# Altium project MOTHERBOARD_hristo.PrjPcb (part 1 of 2)
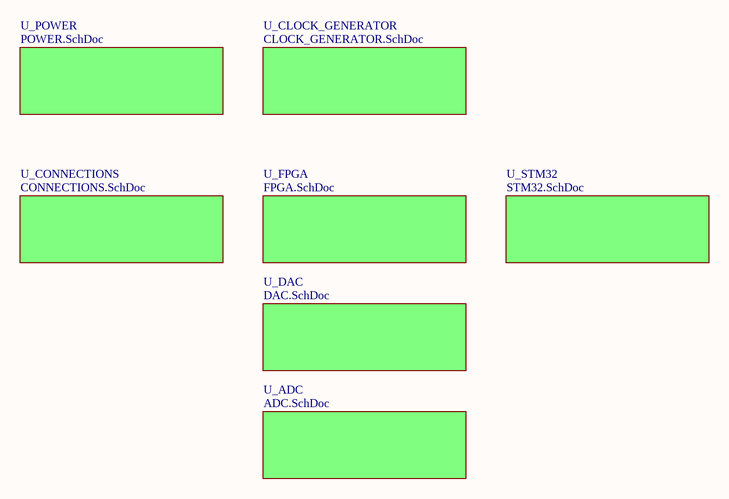
[diagram p0: MOTHERBOARD.SCHDOC]
8 sheets, 230 parts. Net scope: global (net labels, ports and power ports of the same name join across sheets).
Board file: MOTHERBOARD_Hristo_JLC2313.PcbDoc
Sheets:
  MOTHERBOARD.SCHDOC
    U_ADC = ADC.SchDoc
    U_DAC = DAC.SchDoc
    U_FPGA = FPGA.SchDoc
    U_POWER = POWER.SchDoc
    U_STM32 = STM32.SchDoc
    U_CLOCK_GENERATOR = CLOCK_GENERATOR.SchDoc
    U_CONNECTIONS = CONNECTIONS.SchDoc

## Sheet MOTHERBOARD.SCHDOC: MOTHERBOARD
size A4; DocumentNumber: 2; Revision: 2.0; SheetNumber: 2; SheetTotal: 18

### Sub-sheets
U_ADC = ADC.SchDoc: no entries
U_CLOCK_GENERATOR = CLOCK_GENERATOR.SchDoc: no entries
U_CONNECTIONS = CONNECTIONS.SchDoc: no entries
U_DAC = DAC.SchDoc: no entries
U_FPGA = FPGA.SchDoc: no entries
U_POWER = POWER.SchDoc: no entries
U_STM32 = STM32.SchDoc: no entries

### Notes on the sheet
- Title
- Size:
- Date:
- A4
- Number:
- Time:
- Revision:
- Sheet
- of
- File:

## Sheet ADC.SchDoc: ADC
size A4; DocumentNumber: 3; Revision: 2.0; SheetNumber: 3; SheetTotal: 18
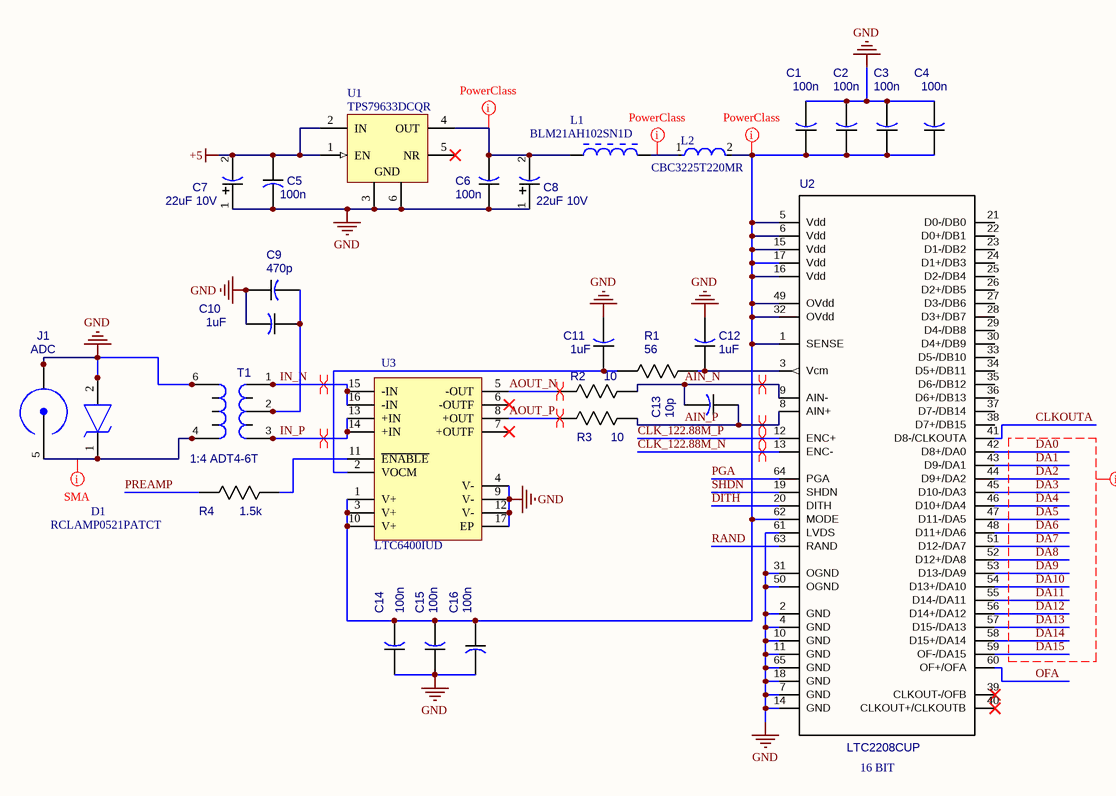
[diagram p1: ADC.SchDoc]

### Parts
C1  100n  [CAP_0805]
C2  100n  [CAP_0805]
C3  100n  [CAP_0805]
C4  100n  [CAP_0805]
C5  100n  [CAP_0805]
C6  100n  [CAP_0805]
C7  22uF 10V  [CAPAE_4.3x4.3h5.4]
C8  22uF 10V  [CAPAE_4.3x4.3h5.4]
C9  470p  [CAP_0805]
C10  1uF  [CAP_0805]
C11  1uF  [CAP_0805]
C12  1uF  [CAP_0805]
C13  10p  [CAP_0805]
C14  100n  [CAP_0805]
C15  100n  [CAP_0805]
C16  100n  [CAP_0805]
D1  RCLAMP0521PATCT  [RCLAMP0521PATCT]
J1  ADC  [31-5431]
L1  BLM21AH102SN1D  [INDC2013X105X50NL20T20]
L2  CBC3225T220MR  [FP-CB3225-IPC_B]
R1  56  [RES_0805]
R2  10  [RES_0603]
R3  10  [RES_0603]
R4  1.5k  [RES_0805]
T1  1:4 ADT4-6T  [TRANSF_ACORE2]
U1  TPS79633DCQR  [DCQ0006A_L]
U2  LTC2208CUP  [LTC2208CUP]
U3  LTC6400IUD  [LT-UD-16_N]

### Nets
+5: C5.1 C7.2(MINUS) U1.1(EN) U1.2(IN)
CLK_122.88M_N: U2.13(ENC-)
CLK_122.88M_P: U2.12(ENC+)
GND: C1.2 C2.2 C3.2 C4.2 C5.2 C6.1 C7.1(PLUS) C8.1(PLUS) C9.1 C10.2 C11.2 C12.2 C14.1 C15.1 C16.2 D1.2(A) J1.1(GND) J1.2(GND) J1.3(GND) J1.4(GND) T1.6(P2) T1.10 U1.3(GND) U1.6(GND) U2.2(GND) U2.4(GND) U2.7(GND) U2.10(GND) U2.11(GND) U2.14(GND) U2.18(GND) U2.31(OGND) U2.50(OGND) U2.61(LVDS) U2.65(GND) U3.4(V-) U3.9(V-) U3.12(V-) U3.17(EP)
AIN_N: C13.2 R2.2 U2.9(AIN-)
AIN_P: C13.1 R3.2 U2.8(AIN+)
AOUT_N: R2.1 U3.5(-OUT)
AOUT_P: R3.1 U3.8(+OUT)
CLKOUTA: U2.41(D8-/CLKOUTA)
DA0: U2.42(D8+/DA0)
DA1: U2.43(D9-/DA1)
DA2: U2.44(D9+/DA2)
DA3: U2.45(D10-/DA3)
DA4: U2.46(D10+/DA4)
DA5: U2.47(D11-/DA5)
DA6: U2.48(D11+/DA6)
DA7: U2.51(D12-/DA7)
DA8: U2.52(D12+/DA8)
DA9: U2.53(D13-/DA9)
DA10: U2.54(D13+/DA10)
DA11: U2.55(D14-/DA11)
DA12: U2.56(D14+/DA12)
DA13: U2.57(D15-/DA13)
DA14: U2.58(D15+/DA14)
DA15: U2.59(OF-/DA15)
DITH: U2.20(DITH)
IN_N: T1.1(S3) T1.7 U3.15(-IN) U3.16(-IN)
IN_P: T1.3(S1) T1.9 U3.13(+IN) U3.14(+IN)
OFA: U2.60(OF+/OFA)
PGA: U2.64(PGA)
PREAMP: R4.2
RAND: U2.63(RAND)
SHDN: U2.19(SHDN)
NetC1_1: C1.1 C2.1 C3.1 C4.1 C14.2 C15.2 C16.1 L2.2 U2.1(SENSE) U2.5(Vdd) U2.6(Vdd) U2.15(Vdd) U2.16(Vdd) U2.17(Vdd) U2.32(OVdd) U2.49(OVdd) U2.62(MODE) U3.1(V+) U3.3(V+) U3.10(V+)
NetC6_2: C6.2 C8.2(MINUS) L1.1 U1.4(OUT)
NetC9_2: C9.2 C10.1 T1.2(S2) T1.8
NetC11_1: C11.1 R1.1 U3.2(VOCM)
NetC12_1: C12.1 R1.2 U2.3(Vcm)
NetD1_1: D1.1(K) J1.5(CON) T1.4(P1) T1.11
NetL1_2: L1.2 L2.1
NetR4_1: R4.1 U3.11(~{ENABLE})

Not connected (* = marked no-connect by the designer): U1 5(NR)*; U2 21(D0-/DB0) 22(D0+/DB1) 23(D1-/DB2) 24(D1+/DB3) 25(D2-/DB4) 26(D2+/DB5) 27(D3-/DB6) 28(D3+/DB7) 29(D4-/DB8) 30(D4+/DB9) 33(D5-/DB10) 34(D5+/DB11) 35(D6-/DB12) 36(D6+/DB13) 37(D7-/DB14) 38(D7+/DB15) 39(CLKOUT-/OFB)* 40(CLKOUT+/CLKOUTB)*; U3 6(-OUTF)* 7(+OUTF)*

### Layout directives
rule Width Constraint [Pref Impedance = 50.00ohms    Min Impedance = 50.00ohms    Max Impedance = 50.00ohms]: NetD1_1
differential pair: AIN_N, AIN_P, AOUT_N, AOUT_P, CLK_122.88M_N, CLK_122.88M_P, IN_N, IN_P
net class PowerPads: NetC1_1, NetC6_2, NetL1_2
net class ADC_DATA: DA0, DA1, DA2, DA3, DA4, DA5, DA6, DA7, DA8, DA9, DA10, DA11, DA12, DA13, DA14, DA15

### Notes on the sheet
- 16 BIT
- Title
- Size:
- Date:
- A4
- Number:
- Time:
- Revision:
- Sheet
- of
- File:

### Library data of the parts
C1-C6 C9-C16 = CAP_0805
  C1-C6 C14-C16: Value: 100n
  C9: Value: 470p
  C10-C12: Value: 1uF
  C13: Value: 10p
C7 C8 = CAPAE_4.3x4.3h5.4: Value: *
D1 = RCLAMP0521PATCT: TVS Diode (Uni-directional); Manufacturer_Name: SEMTECH; Datasheet Link: https://datasheet.datasheetarchive.com/originals/distributors/Datasheets-DGA26/1841510.pdf; Manufacturer_Part_Number: RCLAMP0521PATCT; Mouser Part Number: 947-RCLAMP0521PATCT; Mouser Price/Stock: https://www.mouser.co.uk/ProductDetail/Semtech/RCLAMP0521PATCT?qs=rBWM4%252BvDhIfB36%252BFxGdBkA%3D%3D; Arrow Part Number: RCLAMP0521PATCT; Arrow Price/Stock: https://www.arrow.com/en/products/rclamp0521patct/semtech?region=nac
J1 = 31-5431: SMA; Value: ADC
L1 = CMP-2000-05954-1: Chip Bead, 1000 Ohm, +/- 25%, 200 mA, -55 to 85 degC, 2-Pin SMD, RoHS, Tape and Reel; Manufacturer: Murata; Brand: MurataElectronics; Test Frequency: 100MHz; Maximum DC Resistance: 450mOhms; Case Length: 2mm; Maximum DC Current: 200mA; Case Height: 0.85mm; Case Width: 1.25mm; Impedance: 1kOhms; Datasheet URL: http://datasheet.octopart.com/BLM21AH102SN1D-Murata-datasheet-629859.pdf; Datasheet Version: 11/2017; Dimensions: 1.25mmWx2mmLx0.85mmH; Manufacturer URL: http://www.murata.com/; Packaging: Reel; Product: FerriteChipBeads; Product Category: EMIFilterBeads,Chips&Arrays; Operating Temperature Range: -55Cto+125C; Package / Case: 0805(2012metric); Series: BLM21A; Mounting Technology: SurfaceMount; Termination Style: SMD/SMT; Tolerance: 25%; RoHS: Details; Package Reference: 0805; Factory Pack Quantity: 4000; Package Description: 2-Pin Surface Mount Device, Body 2 x1.25 mm
L2 = CMP-14484-000363-1: SMD Inductors 22uH ±20% 0.78A 0.351Ω 1210; Test Frequency: 100kHz; DC Current: 780mA; Core Material: Ferrite; Self Resonant Frequency: 17MHz; DC Resistance (DCR): 351mR; Saturation Current: 620mA; Shielding: Unshielded; Height: 2.5mm; Tolerance: 20%; Max Operating Temperature: 105°C; Inductance: 22uH; Series: CB; Width: 0.098inch; Military Standard: Not; RoHS Compliant: Yes; Depth: 2.7mm; Max DC Current: 780mA; Package Quantity: 1000; Lead Free: Lead Free; Number of Pins: 2; Min Operating Temperature: -40°C; Current Rating: 780mA; Halogen Free: Halogen Free; Radiation Hardening: No; Case Code (Metric): 3225; Inductance Tolerance: 20%; Case Code (Imperial): 1210; Termination: SMD/SMT; Resistor Type: Wirewound; Mount: Surface Mount; Case/Package: 1210; Length: 0.126inch; Height - Seated (Max): 0.106inch; Packaging: Tape and Reel
R1 R4 = RES_0805
  R1: Value: 56
  R4: Value: 1.5k
R2 R3 = RES_0603: Value: 10
T1 = TRANSF_ACORE2: Transformer; Value: 1:4 ADT4-6T
U1 = CMP-0395-00327-2: Single Output High PSRR LDO, 1 A, Fixed 3.3 V Output, 2.7 to 5.5 V Input, 6-pin SOT-223 (DCQ), -40 to 125 degC, Green (RoHS & no Sb/Br); Manufacturer: Texas Instruments; Accuracy(%): 2; Iout(Max)(A): 1; Vdo(Typ)(mV): 220; SubFamily: Single Channel LDO; Vout Adj(Min)(V): 3.3; Vin(Max)(V): 5.5; Iq(Typ)(mA): 0.26; Vin(Min)(V): 2.7; DatasheetVersion: SLVS351N; ComponentLink2Description: Datasheet; PartNumber: TPS79633DCQR; PackageDescription: 6-Pin Plastic Small Outline, Body 3.5 x 6.5 mm, Pitch 1.27 mm; ComponentLink1Description: Manufacturer URL; ComponentLink2URL: http://www.ti.com/general/docs/lit/getliterature.tsp?genericPartNumber=TPS79633&fileType=pdf; ComponentLink3URL: http://www.ti.com/litv/pdf/mpds098c; Mounting Technology: Surface Mount; Fixed Output Options(V): 3.3; PackageReference: DCQ0006A; ComponentLink1URL: http://www.ti.com/; PackageVersion: 4202109/D; ComponentLink3Description: Package Specification; Vout Adj(Max)(V): 3.3; Eco-Plan: Green (RoHS & no Sb/Br)
U3 = CMP-0359-03855-2: Single Channel, Low Noise, Low Distortion Differential ADC Driver for 300 MHz IF, 1800 MHz Typical GBW, 4500 V/us Typical SR, 2.85 to 3.5 V, 16-Pin QFN (UD-16), Industrial, Pb-Free; Manufacturer: Linear Technology; Linear Technology Part Number: LTC6400-20; PartNumber: LTC6400IUD-20#PBF; Vs Min (V): 2.85; SR (V/us) Typical: 4500; Is (mA) Typical: 90; Vs Max (V): 3.5; Vos (mV) Typical: 2; GBW (MHz) Typical: 1800; Channels (#): 1; RoHS: Pb-Free; PackageReference: LT-UD-16; Type: DIFF; ComponentLink3Description: Package Specification; PackageDescription: 16-Lead Plastic QFN, Body 3.00 x 3.00 mm, Pitch 0.5 mm; ComponentLink1URL: http://www.linear.com/; Mounting Technology: Surface Mount; ComponentLink2URL: http://cds.linear.com/docs/en/datasheet/640020f.pdf; Code_JEDEC: MO-220; ComponentLink3URL: http://cds.linear.com/docs/en/packaging/QFN_16_05-08-1691.pdf; ComponentLink2Description: Datasheet; ComponentLink1Description: Manufacturer URL; RevisionNote: URLs updated
U2 = LTC2208CUP: Value: LTC2208CUP

## Sheet DAC.SchDoc: DAC
size A4; DocumentNumber: 8; Revision: 2.0; SheetNumber: 8; SheetTotal: 18
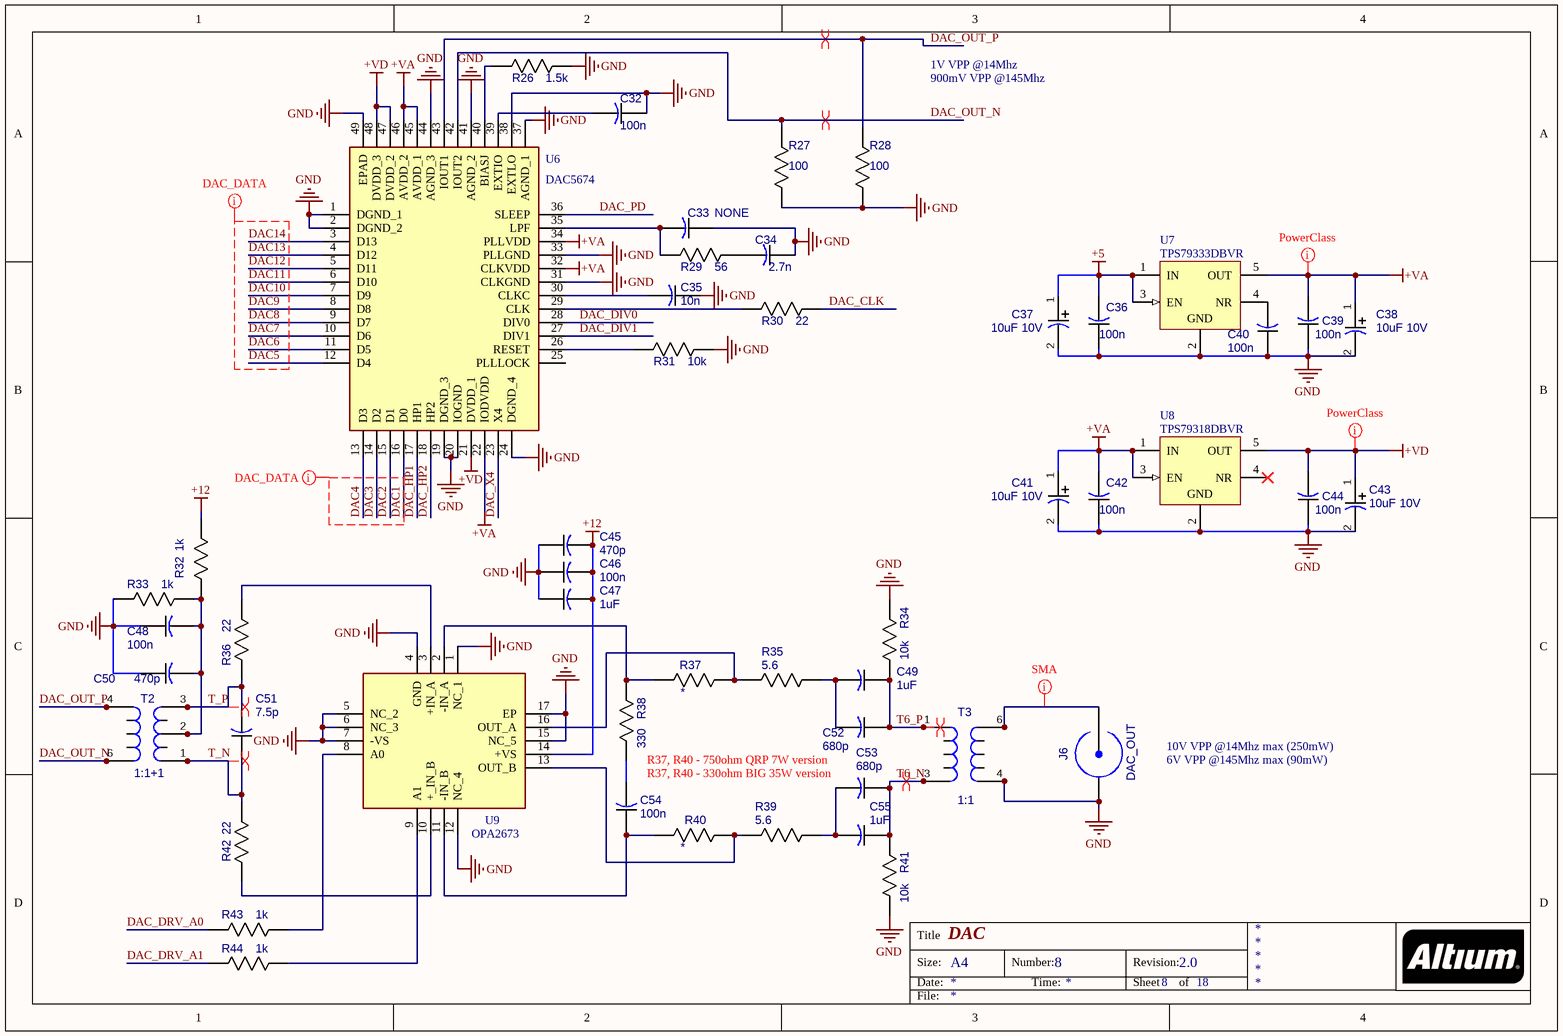
[diagram p2: DAC.SchDoc]

### Parts
C32  100n  [CAP_0805]
C33  NONE  [CAP_0805]
C34  2.7n  [CAP_0805]
C35  10n  [CAP_0805]
C36  100n  [CAP_0805]
C37  10uF 10V  [CAPAE_4.3x4.3h5.4]
C38  10uF 10V  [CAPAE_4.3x4.3h5.4]
C39  100n  [CAP_0805]
C40  100n  [CAP_0805]
C41  10uF 10V  [CAPAE_4.3x4.3h5.4]
C42  100n  [CAP_0805]
C43  10uF 10V  [CAPAE_4.3x4.3h5.4]
C44  100n  [CAP_0805]
C45  470p  [CAP_0805]
C46  100n  [CAP_0805]
C47  1uF  [CAP_0805]
C48  100n  [CAP_0805]
C49  1uF  [CAP_1206]
C50  470p  [CAP_0805]
C51  7.5p  [CAP_0805]
C52  680p  [CAP_1206]
C53  680p  [CAP_1206]
C54  100n  [CAP_0805]
C55  1uF  [CAP_1206]
J6  DAC_OUT  [31-5431]
R26  1.5k  [RES_0805]
R27  100  [RES_0805]
R28  100  [RES_0805]
R29  56  [RES_0805]
R30  22  [RES_0805]
R31  10k  [RES_0805]
R32  1k  [RES_0805]
R33  1k  [RES_0805]
R34  10k  [RES_0805]
R35  5.6  [RES_1206]
R36  22  [RES_0805]
R37  *  [RES_0805]
R38  330  [RES_0805]
R39  5.6  [RES_1206]
R40  *  [RES_0805]
R41  10k  [RES_0805]
R42  22  [RES_0805]
R43  1k  [RES_0805]
R44  1k  [RES_0805]
T2  1:1+1  [TRANSF_ACORE2]
T3  1:1  [TRANSF_ACORE]
U6  DAC5674  [QFP50P900X900X100-49N]
U7  TPS79333DBVR  [DBV0005A_L]
U8  TPS79318DBVR  [DBV0005A_L]
U9  OPA2673  [QFN65P400X400X100-17N-D]

### Nets
+5: C36.2 C37.1(PLUS) U7.1(IN) U7.3(EN)
+12: C45.2 C46.2 C47.2 R32.2 U9.14(+VS)
+VA: C38.1(PLUS) C39.2 C41.1(PLUS) C42.2 U6.22(IODVDD) U6.32(CLKVDD) U6.34(PLLVDD) U6.45(AVDD_1) U6.46(AVDD_2) U7.5(OUT) U8.1(IN) U8.3(EN)
+VD: C43.1(PLUS) C44.2 U6.21(DVDD_1) U6.47(DVDD_2) U6.48(DVDD_3) U8.5(OUT)
GND: C32.1 C33.1 C34.1 C35.1 C36.1 C37.2(MINUS) C38.2(MINUS) C39.1 C40.1 C41.2(MINUS) C42.1 C43.2(MINUS) C44.1 C45.1 C46.1 C47.1 C48.1 C50.1 J6.1(GND) J6.2(GND) J6.3(GND) J6.4(GND) R26.1 R27.1 R28.1 R31.1 R33.2 R34.1 R41.2 T3.4(S2) T3.11 U6.1(DGND_1) U6.2(DGND_2) U6.19(DGND_3) U6.20(IOGND) U6.24(DGND_4) U6.31(CLKGND) U6.33(PLLGND) U6.37(AGND_1) U6.38(EXTLO) U6.41(AGND_2) U6.44(AGND_3) U6.49(EPAD) U7.2(GND) U8.2(GND) U9.1(NC_1) U9.4(GND) U9.5(NC_2) U9.6(NC_3) U9.7(-VS) U9.12(NC_4) U9.15(NC_5) U9.17(EP)
DAC1: U6.16(D0)
DAC2: U6.15(D1)
DAC3: U6.14(D2)
DAC4: U6.13(D3)
DAC5: U6.12(D4)
DAC6: U6.11(D5)
DAC7: U6.10(D6)
DAC8: U6.9(D7)
DAC9: U6.8(D8)
DAC10: U6.7(D9)
DAC11: U6.6(D10)
DAC12: U6.5(D11)
DAC13: U6.4(D12)
DAC14: U6.3(D13)
DAC_CLK: R30.1
DAC_DIV0: U6.28(DIV0)
DAC_DIV1: U6.27(DIV1)
DAC_DRV_A0: R43.1
DAC_DRV_A1: R44.1
DAC_HP1: U6.17(HP1)
DAC_HP2: U6.18(HP2)
DAC_OUT_N: R27.2 T2.6(P2) T2.10 U6.42(IOUT2)
DAC_OUT_P: R28.2 T2.4(P1) T2.11 U6.43(IOUT1)
DAC_PD: U6.36(SLEEP)
DAC_X4: U6.23(X4)
T6_N: C53.1 C55.1 R41.1 T3.3(P2) T3.9
T6_P: C49.1 C52.1 R34.2 T3.1(P1) T3.7
T_N: C51.1 R42.2 T2.1(S3) T2.7
T_P: C51.2 R36.1 T2.3(S1) T2.9
NetC32_2: C32.2 U6.39(EXTIO)
NetC33_2: C33.2 R29.2 U6.35(LPF)
NetC34_2: C34.2 R29.1
NetC35_2: C35.2 U6.30(CLKC)
NetC40_2: C40.2 U7.4(NR)
NetC48_2: C48.2 C50.2 R32.1 R33.1 T2.2(S2) T2.8
NetC49_2: C49.2 C52.2 R35.1
NetC53_2: C53.2 C55.2 R39.1
NetC54_1: C54.1 R40.2 U9.11(-IN_B)
NetC54_2: C54.2 R38.2
NetJ6_5: J6.5(CON) T3.6(S1) T3.10
NetR26_2: R26.2 U6.40(BIASJ)
NetR30_2: R30.2 U6.29(CLK)
NetR31_2: R31.2 U6.26(RESET)
NetR35_2: R35.2 R37.1 U9.16(OUT_A)
NetR36_2: R36.2 U9.3(+IN_A)
NetR37_2: R37.2 R38.1 U9.2(-IN_A)
NetR39_2: R39.2 R40.1 U9.13(OUT_B)
NetR42_1: R42.1 U9.10(+_IN_B)
NetR43_2: R43.2 U9.8(A0)
NetR44_2: R44.2 U9.9(A1)

Not connected (* = marked no-connect by the designer): T3 8(0); U6 25(PLLLOCK); U8 4(NR)*

### Layout directives
rule Width Constraint [Pref Impedance = 50.00ohms    Min Impedance = 50.00ohms    Max Impedance = 50.00ohms]: NetJ6_5
differential pair: DAC_OUT_N, DAC_OUT_P, T6_N, T6_P, T_N, T_P
net class PowerPads: +VA, +VD
net class DAC_DATA: DAC1, DAC2, DAC3, DAC4, DAC5, DAC6, DAC7, DAC8, DAC9, DAC10, DAC11, DAC12, DAC13, DAC14

### Notes on the sheet
- 1V VPP @14Mhz
- 900mV VPP @145Mhz
- R37, R40 - 750ohm QRP 7W version
- (near C53) R37, R40 - 330ohm BIG 35W version
- 10V VPP @14Mhz max (250mW)
- 6V VPP @145Mhz max (90mW)
- Title
- Size:
- Date:
- A4
- Number:
- Time:
- Revision:
- Sheet
- of
- File:

### Library data of the parts
C32-C36 C39 C40 C42 C44-C48 C50 C51 C54 = CAP_0805
  C36 C39 C40 C42 C44 C46 C48 C54: Value: 100n
  C45 C50: Value: 470p
  C47: Value: 1uF
C37 C38 C41 C43 = CAPAE_4.3x4.3h5.4: Value: 10uF 10V
C49 C52 C53 C55 = CAP_1206
  C49 C55: Value: 1uF
  C52 C53: Value: 680p
J6 = 31-5431: SMA; Value: DAC_OUT
R26-R34 R36-R38 R40-R44 = RES_0805
  R32 R33: Value: 1k
  R34 R41: Value: 10k
  R36 R42: Value: 22
  R38: Value: 330
R35 R39 = RES_1206: Value: 5.6
T2 = TRANSF_ACORE2: Transformer; Value: 1:1+1
T3 = TRANSF_ACORE: Transformer; Value: 1:1
U6 = DAC5674IPHP: Integrated Circuit; Manufacturer_Name: Texas Instruments; Datasheet Link: https://www.ti.com/lit/ds/symlink/dac5674.pdf; Height: 1mm; Manufacturer_Part_Number: DAC5674IPHP
U7 = CMP-0394-00364-2: Single Output High PSRR LDO, 200 mA, Fixed 3.3 V Output, 2.7 to 5.5 V Input, 5-pin SOT-23 (DBV), -40 to 85 degC, Green (RoHS & no Sb/Br); Manufacturer: Texas Instruments; Iout(Max)(A): 0.2; Rating: Catalog; Vin(Min)(V): 2.7; Vdo(Typ)(mV): 102; Fixed Output Options(V): 3.3; Accuracy(%): 2; SubFamily: Single Channel LDO; Vin(Max)(V): 5.5; ComponentLink1URL: http://www.ti.com/; ComponentLink2URL: http://www.ti.com/general/docs/lit/getliterature.tsp?genericPartNumber=TPS79333&fileType=pdf; ComponentLink1Description: Manufacturer URL; PackageDescription: 5-Pin Plastic Small Outline, Body 1.60 Ãƒâ€” 2.90 mm, Pitch 0.95 mm; ComponentLink3URL: http://www.ti.com/litv/pdf/mpds018i; ComponentLink2Description: Datasheet; Mounting Technology: Surface Mount; ComponentLink3Description: Package Specification; PackageReference: DBV0005A; Code_JEDEC: MO-178; PartNumber: TPS79333DBVR; Vout Adj(Min)(V): 3.3; DatasheetVersion: SLVS348K; Eco-Plan: Green (RoHS & no Sb/Br); PackageVersion: 4073253-4/K; Vout Adj(Max)(V): 3.3; Iq(Typ)(mA): 0.2
U8 = CMP-0394-00328-2: Single Output High PSRR LDO, 200 mA, Fixed 1.8 V Output, 2.7 to 5.5 V Input, 5-pin SOT-23 (DBV), -40 to 85 degC, Green (RoHS & no Sb/Br); Manufacturer: Texas Instruments; Vdo(Typ)(mV): 112; SubFamily: Single Channel LDO; Iq(Typ)(mA): 0.2; Vin(Max)(V): 5.5; Accuracy(%): 2; Rating: Catalog; Vin(Min)(V): 2.7; Vout Adj(Max)(V): 1.8; ComponentLink3URL: http://www.ti.com/litv/pdf/mpds018i; PackageVersion: 4073253-4/K; Eco-Plan: Green (RoHS & no Sb/Br); ComponentLink3Description: Package Specification; PackageDescription: 5-Pin Plastic Small Outline, Body 1.60 Ãƒâ€” 2.90 mm, Pitch 0.95 mm; Mounting Technology: Surface Mount; DatasheetVersion: SLVS348K; PartNumber: TPS79318DBVR; ComponentLink1Description: Manufacturer URL; ComponentLink2Description: Datasheet; PackageReference: DBV0005A; Iout(Max)(A): 0.2; Fixed Output Options(V): 1.8; Vout Adj(Min)(V): 1.8; Code_JEDEC: MO-178; ComponentLink1URL: http://www.ti.com/; ComponentLink2URL: http://www.ti.com/general/docs/lit/getliterature.tsp?genericPartNumber=TPS79318&fileType=pdf
U9 = OPA2673IRGVT: Integrated Circuit; Manufacturer_Name: Texas Instruments; Datasheet Link: http://www.ti.com/lit/gpn/opa2673; Height: 1mm; Manufacturer_Part_Number: OPA2673IRGVT; Mouser Part Number: 595-OPA2673IRGVT; Mouser Price/Stock: https://www.mouser.co.uk/ProductDetail/Texas-Instruments/OPA2673IRGVT?qs=xHCJPbHdANbeLKV0FJjs6g%3D%3D; RS Part Number: 8122587P; RS Price/Stock: http://uk.rs-online.com/web/p/products/8122587P

## Sheet FPGA.SchDoc: FPGA
size A3; DocumentNumber: 9; Revision: 2.0; SheetNumber: 9; SheetTotal: 18
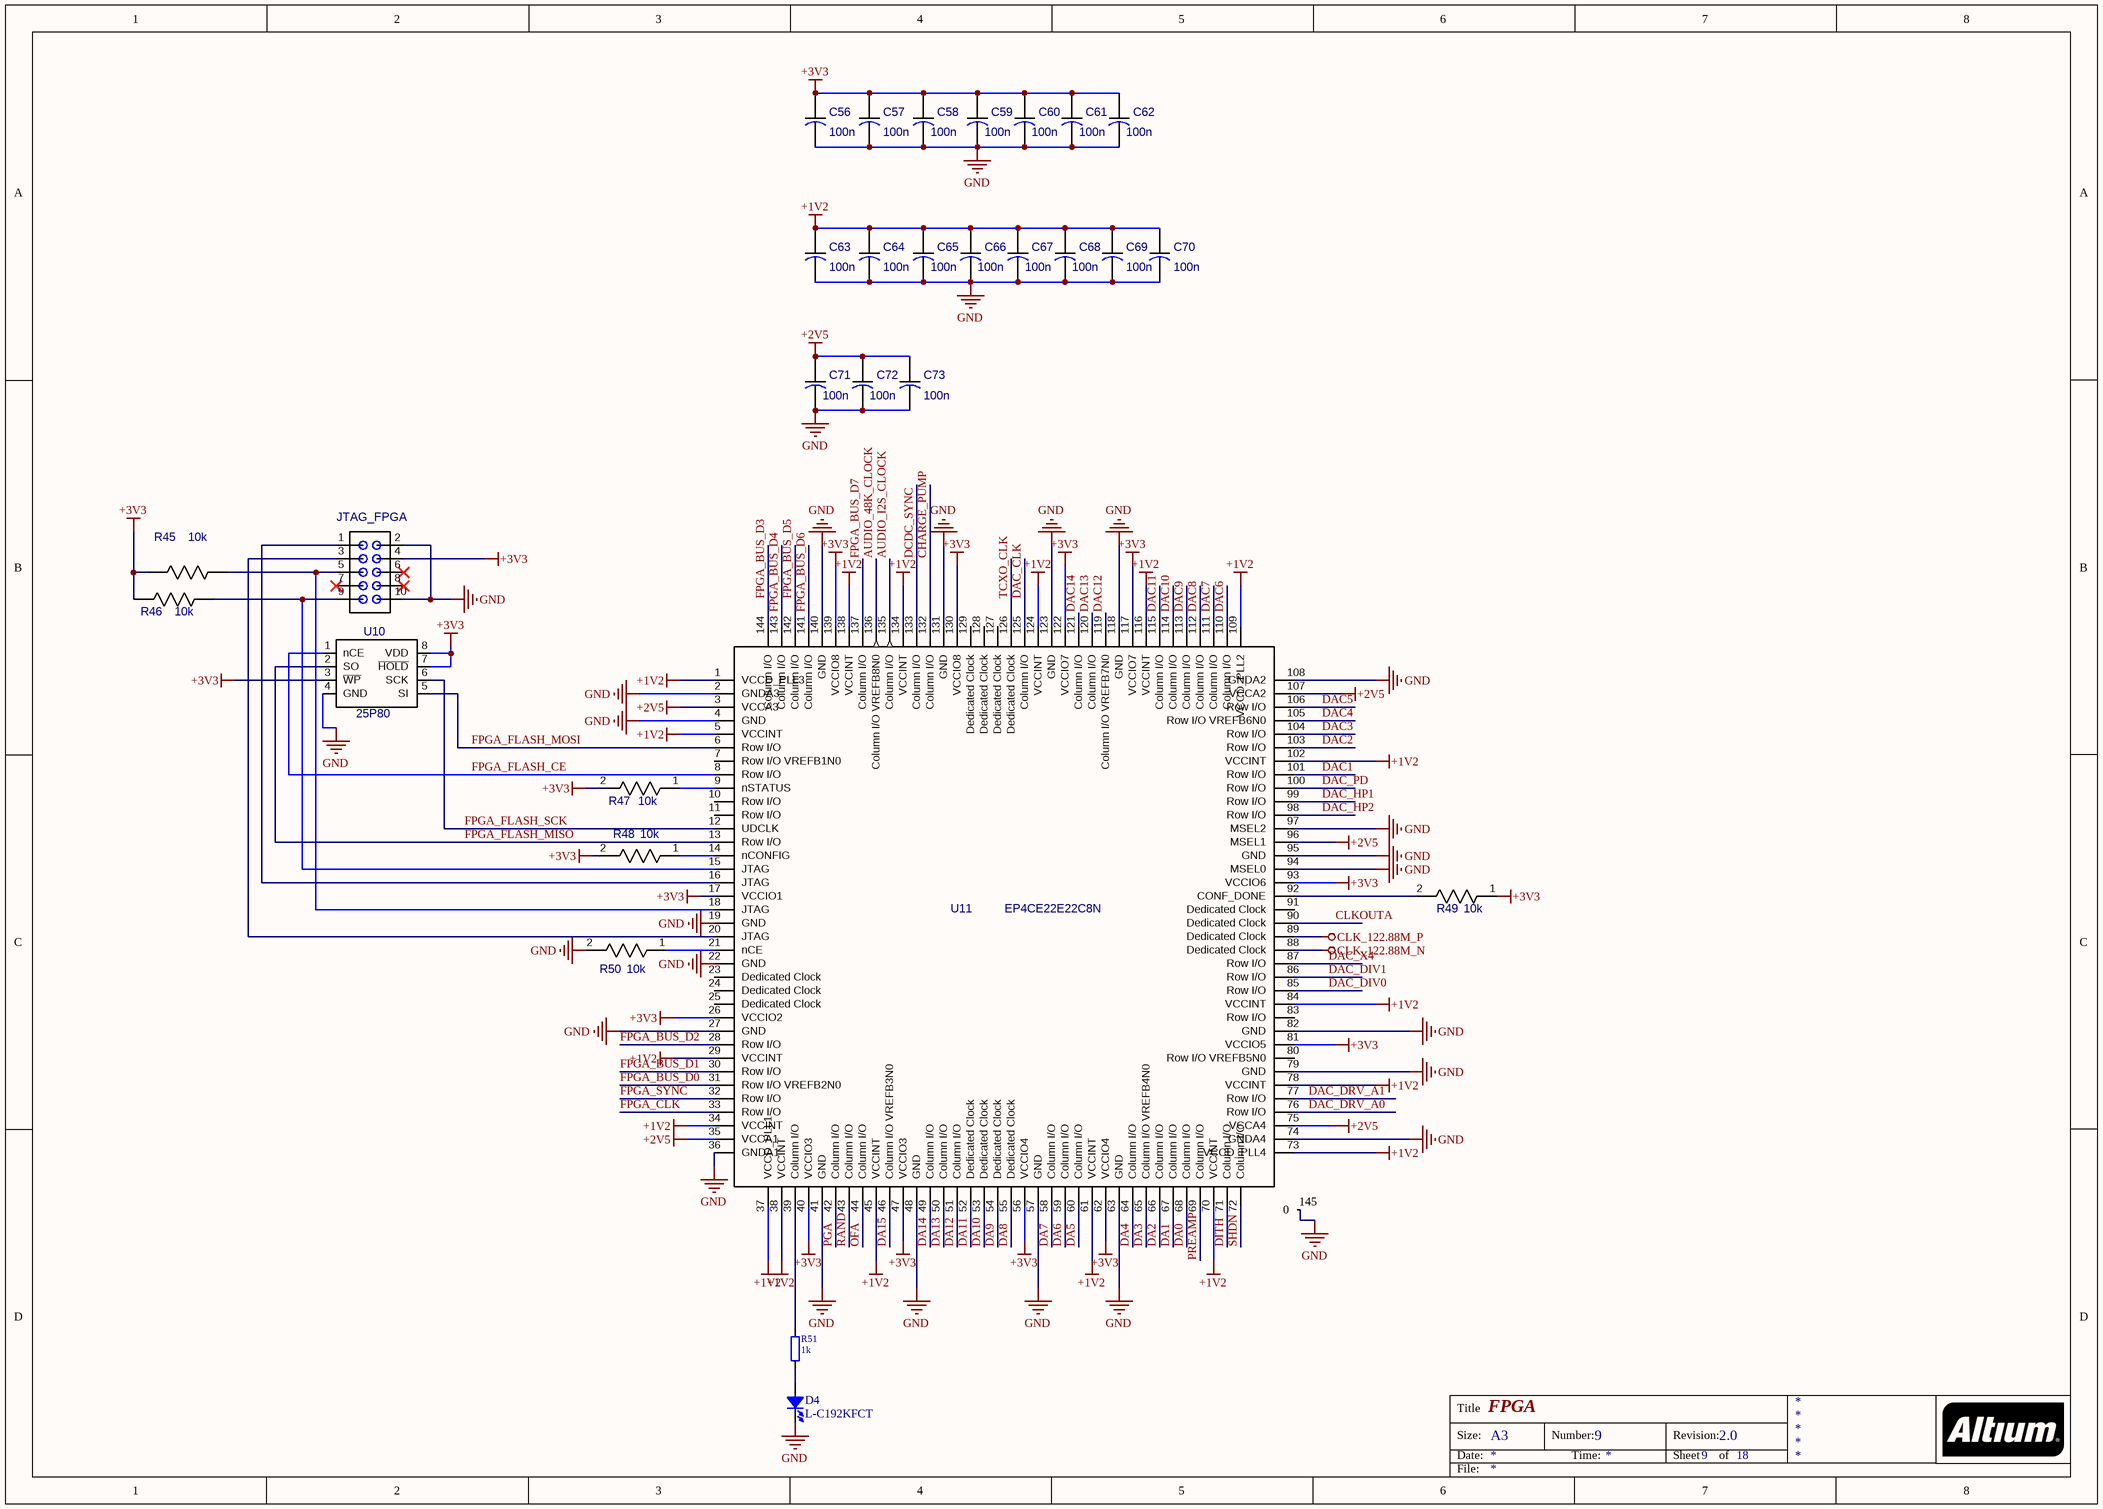
[diagram p3: FPGA.SchDoc]

### Parts
C56  100n  [CAP_0805]
C57  100n  [CAP_0805]
C58  100n  [CAP_0805]
C59  100n  [CAP_0805]
C60  100n  [CAP_0805]
C61  100n  [CAP_0805]
C62  100n  [CAP_0805]
C63  100n  [CAP_0805]
C64  100n  [CAP_0805]
C65  100n  [CAP_0805]
C66  100n  [CAP_0805]
C67  100n  [CAP_0805]
C68  100n  [CAP_0805]
C69  100n  [CAP_0805]
C70  100n  [CAP_0805]
C71  100n  [CAP_0805]
C72  100n  [CAP_0805]
C73  100n  [CAP_0805]
D4  L-C192KFCT  [LED 0603]
JTAG_FPGA  (no value)  [IDC10]
R45  10k  [RES_0805]
R46  10k  [RES_0805]
R47  10k  [RES_0805]
R48  10k  [RES_0805]
R49  10k  [RES_0805]
R50  10k  [RES_0805]
R51  1k  [R-0603]
U10  25P80  [25P80]
U11  EP4CE22E22C8N  [QFP144-20-2222A]

### Nets
+1V2: C63.1 C64.1 C65.1 C66.1 C67.1 C68.1 C69.1 C70.1 U11.1(VCCD_PLL3) U11.5(VCCINT) U11.29(VCCINT) U11.34(VCCINT) U11.37(VCCD_PLL1) U11.38(VCCINT) U11.45(VCCINT) U11.61(VCCINT) U11.70(VCCINT) U11.73(VCCD_PLL4) U11.78(VCCINT) U11.84(VCCINT) U11.102(VCCINT) U11.109(VCCD_PLL2) U11.116(VCCINT) U11.124(VCCINT) U11.134(VCCINT) U11.138(VCCINT)
+2V5: C71.1 C72.1 C73.1 U11.3(VCCA3) U11.35(VCCA1) U11.75(VCCA4) U11.96(MSEL1) U11.107(VCCA2)
+3V3: C56.1 C57.1 C58.1 C59.1 C60.1 C61.1 C62.1 JTAG_FPGA.4 R45.2 R46.2 R47.2 R48.2 R49.1 U10.3(~{WP}) U10.7(~{HOLD}) U10.8(VDD) U11.17(VCCIO1) U11.26(VCCIO2) U11.40(VCCIO3) U11.47(VCCIO3) U11.56(VCCIO4) U11.62(VCCIO4) U11.81(VCCIO5) U11.93(VCCIO6) U11.117(VCCIO7) U11.122(VCCIO7) U11.130(VCCIO8) U11.139(VCCIO8)
CLK_122.88M_N: U11.88(Dedicated_Clock)
CLK_122.88M_P: U11.89(Dedicated_Clock)
GND: C56.2 C57.2 C58.2 C59.2 C60.2 C61.2 C62.2 C63.2 C64.2 C65.2 C66.2 C67.2 C68.2 C69.2 C70.2 C71.2 C72.2 C73.2 D4.2 JTAG_FPGA.2 JTAG_FPGA.10 R50.2 U10.4(GND) U11.2(GNDA3) U11.4(GND) U11.19(GND) U11.22(GND) U11.27(GND) U11.36(GNDA1) U11.41(GND) U11.48(GND) U11.57(GND) U11.63(GND) U11.74(GNDA4) U11.79(GND) U11.82(GND) U11.94(MSEL0) U11.95(GND) U11.97(MSEL2) U11.108(GNDA2) U11.118(GND) U11.123(GND) U11.131(GND) U11.140(GND) U11.145(0)
AUDIO_48K_CLOCK: U11.136(Column_I/O_VREFB8N0)
AUDIO_I2S_CLOCK: U11.135(Column_I/O)
CHARGE_PUMP: U11.132(Column_I/O)
CLKOUTA: U11.90(Dedicated_Clock)
DA0: U11.68(Column_I/O)
DA1: U11.67(Column_I/O)
DA2: U11.66(Column_I/O)
DA3: U11.65(Column_I/O_VREFB4N0)
DA4: U11.64(Column_I/O)
DA5: U11.60(Column_I/O)
DA6: U11.59(Column_I/O)
DA7: U11.58(Column_I/O)
DA8: U11.55(Dedicated_Clock)
DA9: U11.54(Dedicated_Clock)
DA10: U11.53(Dedicated_Clock)
DA11: U11.52(Dedicated_Clock)
DA12: U11.51(Column_I/O)
DA13: U11.50(Column_I/O)
DA14: U11.49(Column_I/O)
DA15: U11.46(Column_I/O_VREFB3N0)
DAC1: U11.101(Row_I/O)
DAC2: U11.103(Row_I/O)
DAC3: U11.104(Row_I/O)
DAC4: U11.105(Row_I/O_VREFB6N0)
DAC5: U11.106(Row_I/O)
DAC6: U11.110(Column_I/O)
DAC7: U11.111(Column_I/O)
DAC8: U11.112(Column_I/O)
DAC9: U11.113(Column_I/O)
DAC10: U11.114(Column_I/O)
DAC11: U11.115(Column_I/O)
DAC12: U11.119(Column_I/O_VREFB7N0)
DAC13: U11.120(Column_I/O)
DAC14: U11.121(Column_I/O)
DAC_CLK: U11.125(Column_I/O)
DAC_DIV0: U11.85(Row_I/O)
DAC_DIV1: U11.86(Row_I/O)
DAC_DRV_A0: U11.76(Row_I/O)
DAC_DRV_A1: U11.77(Row_I/O)
DAC_HP1: U11.99(Row_I/O)
DAC_HP2: U11.98(Row_I/O)
DAC_PD: U11.100(Row_I/O)
DAC_X4: U11.87(Row_I/O)
DCDC_SYNC: U11.133(Column_I/O)
DITH: U11.71(Column_I/O)
FPGA_BUS_D0: U11.31(Row_I/O_VREFB2N0)
FPGA_BUS_D1: U11.30(Row_I/O)
FPGA_BUS_D2: U11.28(Row_I/O)
FPGA_BUS_D3: U11.144(Column_I/O)
FPGA_BUS_D4: U11.143(Column_I/O)
FPGA_BUS_D5: U11.142(Column_I/O)
FPGA_BUS_D6: U11.141(Column_I/O)
FPGA_BUS_D7: U11.137(Column_I/O)
FPGA_CLK: U11.33(Row_I/O)
FPGA_FLASH_CE: U10.1(nCE) U11.8(Row_I/O)
FPGA_FLASH_MISO: U10.2(SO) U11.13(Row_I/O)
FPGA_FLASH_MOSI: U10.5(SI) U11.6(Row_I/O)
FPGA_FLASH_SCK: U10.6(SCK) U11.12(UDCLK)
FPGA_SYNC: U11.32(Row_I/O)
OFA: U11.44(Column_I/O)
PGA: U11.42(Column_I/O)
PREAMP: U11.69(Column_I/O)
RAND: U11.43(Column_I/O)
SHDN: U11.72(Column_I/O)
TCXO_CLK: U11.126(Dedicated_Clock)
NetD4_1: D4.1 R51.1
NetJTAG_FPGA_1: JTAG_FPGA.1 U11.16(JTAG)
NetJTAG_FPGA_3: JTAG_FPGA.3 U11.20(JTAG)
NetJTAG_FPGA_5: JTAG_FPGA.5 R45.1 U11.18(JTAG)
NetJTAG_FPGA_9: JTAG_FPGA.9 R46.1 U11.15(JTAG)
NetR47_1: R47.1 U11.9(nSTATUS)
NetR48_1: R48.1 U11.14(nCONFIG)
NetR49_2: R49.2 U11.92(CONF_DONE)
NetR50_1: R50.1 U11.21(nCE)
NetR51_2: R51.2 U11.39(Column_I/O)

Not connected (* = marked no-connect by the designer): JTAG_FPGA 6* 7* 8*; U11 7(Row_I/O_VREFB1N0) 10(Row_I/O) 11(Row_I/O) 23(Dedicated_Clock) 24(Dedicated_Clock) 25(Dedicated_Clock) 80(Row_I/O_VREFB5N0) 83(Row_I/O) 91(Dedicated_Clock) 127(Dedicated_Clock) 128(Dedicated_Clock) 129(Dedicated_Clock)

### Notes on the sheet
- Title
- Size:
- Date:
- A3
- Number:
- Time:
- Revision:
- Sheet
- of
- File:

### Library data of the parts
C56-C73 = CAP_0805: Value: 100n
D4 = D LED: SMD LED Diode; Manufacturer: Paralight; Manufacturer P/N: L-C192KFCT
JTAG_FPGA = IDC10: 2*5 Pin
R45-R50 = RES_0805: Value: 10k
R51 = RES semi: Chip Resistor; Manufacturer: Yageo/Phycomp; Manufacturer P/N: RC0603FR-0749R9L; numsch: 021; TypeNum: 212; Parameters: 49.9R, RC, 0.1W, ±1%, TCR ±100ppm; Power: *; TCR: *; Series: *; Tolerance: *
U10 = 25P80: Value: 25P80
U11 = EP4CE22E22C8N: Value: EP4CE22E22C8N

## Sheet POWER.SchDoc: POWER
size A4; DocumentNumber: 10; Revision: 2.0; SheetNumber: 10; SheetTotal: 18
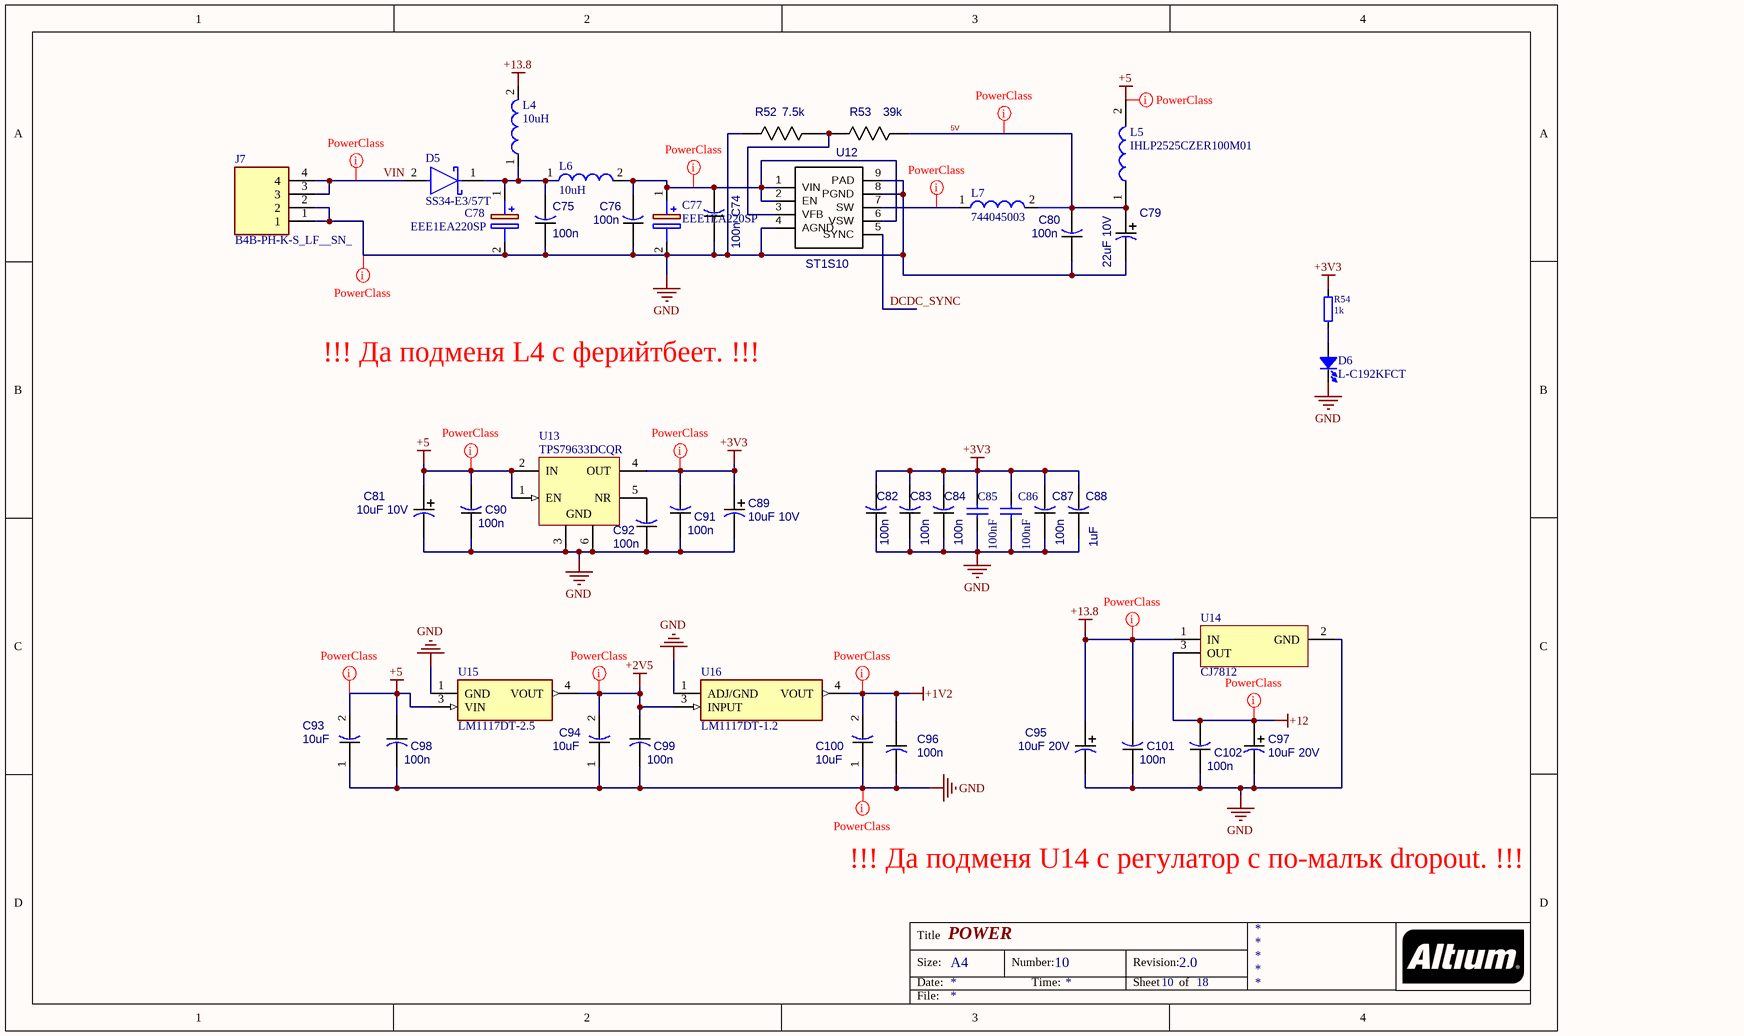
[diagram p4: POWER.SchDoc]

### Parts
C74  100n  [CAP_0805]
C75  100n  [CAP_0805]
C76  100n  [CAP_0805]
C77  EEE1EA220SP  [EEE1AA101SP]
C78  EEE1EA220SP  [EEE1AA101SP]
C79  22uF 10V  [CAPAE_4.3x4.3h5.4]
C80  100n  [CAP_0805]
C81  10uF 10V  [CAPAE_4.3x4.3h5.4]
C82  100n  [CAP_0805]
C83  100n  [CAP_0805]
C84  100n  [CAP_0805]
C85  100nF  [C-0603]
C86  100nF  [C-0603]
C87  100n  [CAP_0805]
C88  value 1uF  [CAP_0805]  (hidden comment: 10uF)
C89  10uF 10V  [CAPAE_4.3x4.3h5.4]
C90  100n  [CAP_0805]
C91  100n  [CAP_0805]
C92  100n  [CAP_0805]
C93  10uF  [CAP_0805]
C94  10uF  [CAP_0805]
C95  10uF 20V  [CAPAE_4.3x4.3h5.4]
C96  100n  [CAP_0805]
C97  10uF 20V  [CAPAE_4.3x4.3h5.4]
C98  100n  [CAP_0805]
C99  100n  [CAP_0805]
C100  10uF  [CAP_0805]
C101  100n  [CAP_0805]
C102  100n  [CAP_0805]
D5  SS34-E3/57T  [FP-95402-MFG]
D6  L-C192KFCT  [LED 0603]
J7  B4B-PH-K-S_LF__SN_  [SHDR4W50P0X200_1X4_990X450X600P]
L4  10uH  [WE-LQ-L]
L5  IHLP2525CZER100M01  [INDPM6965X300N]
L6  10uH  [WE-LQ-L]
L7  744045003  [WE-LQ-L]
R52  7.5k  [RES_0805]
R53  39k  [RES_0805]
R54  1k  [R-0805]
U12  ST1S10  [ST1S10]
U13  TPS79633DCQR  [DCQ0006A_L]
U14  CJ7812  [TO-252-2L]
U15  LM1117DT-2.5  [TO228P991X238-3N]
U16  LM1117DT-1.2  [TO228P991X238-3N]

### Nets
+1V2: C96.1 C100.2 U16.4(VOUT)
+2V5: C94.2 C99.1 U15.4(VOUT) U16.3(INPUT)
+3V3: C82.2 C83.2 C84.2 C85.1 C86.1 C87.2 C88.2 C89.1(PLUS) C91.2 R54.2 U13.4(OUT)
+5: C81.1(PLUS) C90.2 C93.2 C98.1 L5.2 U13.1(EN) U13.2(IN) U15.3(VIN)
+12: C97.1(PLUS) C102.2 U14.3(OUT)
+13.8: C95.1(PLUS) C101.2 L4.2 U14.1(IN)
GND: C74.1 C75.1 C76.1 C77.2(-) C78.2(-) C79.2(MINUS) C80.1 C81.2(MINUS) C82.1 C83.1 C84.1 C85.2 C86.2 C87.1 C88.1 C89.2(MINUS) C90.1 C91.1 C92.1 C93.1 C94.1 C95.2(MINUS) C96.2 C97.2(MINUS) C98.2 C99.2 C100.1 C101.1 C102.1 D6.2 J7.1 J7.2 R52.1 U12.4(AGND) U12.8(PGND) U12.9(PAD) U13.3(GND) U13.6(GND) U14.2(GND) U15.1(GND) U16.1(ADJ/GND)
5V: C79.1(PLUS) C80.2 L5.1 L7.2 R53.2
DCDC_SYNC: U12.5(SYNC)
VIN: D5.2(A) J7.3 J7.4
NetC74_2: C74.2 C76.2 C77.1(+) L6.2 U12.1(VIN) U12.2(EN) U12.6(VSW)
NetC75_2: C75.2 C78.1(+) D5.1(C) L4.1 L6.1
NetC92_2: C92.2 U13.5(NR)
NetD6_1: D6.1 R54.1
NetL7_1: L7.1 U12.7(SW)
NetR52_2: R52.2 R53.1 U12.3(VFB)

### Layout directives
net class PowerPads: 5V, +1V2, +2V5, +3V3, +5, +12, +13.8, GND, NetC74_2, NetL7_1, VIN

### Notes on the sheet
- !!! Да подменя L4 с ферийтбеет. !!!
- !!! Да подменя U14 с регулатор с по-малък dropout. !!!
- Title
- Size:
- Date:
- A4
- Number:
- Time:
- Revision:
- Sheet
- of
- File:

### Library data of the parts
C74-C76 C80 C82-C84 C87 C88 C90-C94 C96 C98-C102 = CAP_0805
  C74-C76 C80 C82-C84 C87 C90-C92 C96 C98 C99 C101 C102: Value: 100n
  C93 C94 C100: Value: 10uF
C77 C78 = EEE1EA220SP: Capacitor Polarised; Manufacturer_Name: Panasonic; Datasheet Link: http://industrial.panasonic.com/cdbs/www-data/pdf/RDE0000/ABA0000C1145.pdf; Height: 7.8mm; Manufacturer_Part_Number: EEE1EA220SP
C79 C81 C89 C95 C97 = CAPAE_4.3x4.3h5.4
  C79: Value: 22uF 10V
  C81 C89: Value: 10uF 10V
  C95 C97: Value: 10uF 20V
C85 C86 = C semi: Ceramic Multilayer Capacitor; Manufacturer: Yageo/Phycomp; Manufacturer P/N: CC0603KRX7R9BB104; numsch: 011; TypeNum: 155; Parameters: 100nF, X7R, 50V, ±10%; Tolerance: ±10%; Voltage: *
D5 = CMP-02539-000012-1: DIODE SCHOTTKY 40V 3A DO214AB; Manufacturer: Vishay; Max Junction Temp: +150°C; Peak Reverse Current: 0.5mA; Max Surge Forward Current: 100A; Standoff Height: 0mm; ComponentLink2Description: Datasheet; Device Class L3: Schottky Diodes; Height: 2.62mm; Max Repetitive Reverse Voltage: 40V; Lead Free: Yes; Package: 95402; Temperature Range High: +150°C; ComponentLink2URL: http://www.vishay.com/docs/88751/ss32.pdf; Temperature: -55°C to +150°C; Footprint Url: http://www.vishay.com/docs/95402/smc.pdf; Automotive: No; Forward Current: 3A; Category: Diode; Manufacturer Part Number: SS34-E3/57T; RoHS: TRUE; Device Class L2: Diodes; Mouser Description: Schottky Diodes & Rectifiers 3.0 Amp 40 Volt; Octopart: https://octopart.com/ss34-e3%2F57t-vishay-39552907; Temperature Range Low: -55°C; Device Class L1: Discrete Semiconductors; Digikey Description: DIODE SCHOTTKY 40V 3A DO214AB
D6 = D LED: SMD LED Diode; Manufacturer: Paralight; Manufacturer P/N: L-C192KFCT
J7 = B4B-PH-K-S_LF__SN_: Connector; Manufacturer_Name: JST (JAPAN SOLDERLESS TERMINALS); Manufacturer_Part_Number: B4B-PH-K-S(LF)(SN); Datasheet Link: https://datasheet.lcsc.com/szlcsc/JST-Sales-America-B4B-PH-K-S-LF-SN_C131334.pdf; Height: 6mm; Arrow Part Number: B4B-PH-K-S(LF)(SN); Arrow Price/Stock: https://www.arrow.com/en/products/b4b-ph-k-s-lf-sn/jst-manufacturing
L4 L6 L7 = CMP-0227-00587-1: SMD-RF-Inductor WE-LQ, L = 3.30 µH; Inductance: 3.30 ÂµH; ComponentLink2URL: http://www.we-online.de/katalog/media/pdf/744045003.pdf; ComponentLink2Description: Datasheet; PackageDescription: Inductor, 2-Leads, Body 4.5 x 3.2 mm; PackageReference: WE-LQ-L; DatasheetVersion: ver 3, Jul-2006; ComponentLink1URL: http://www.we-online.com; ComponentLink1Description: Manufacturer Link; PackageVersion: 2006
L5 = IHLP2525CZER100M01: Inductor; Manufacturer_Name: Vishay; Datasheet Link: https://www.vishay.com/docs/34104/ihlp-2525cz-01.pdf; Height: 3mm; Manufacturer_Part_Number: IHLP2525CZER100M01; Mouser Part Number: 70-IHLP2525CZER100M0; Mouser Price/Stock: https://www.mouser.co.uk/ProductDetail/Vishay-Dale/IHLP2525CZER100M01?qs=PA%252BPfIdQ8xl3JLrMc5InbA%3D%3D; Arrow Part Number: IHLP2525CZER100M01; Arrow Price/Stock: https://www.arrow.com/en/products/ihlp2525czer100m01/vishay?region=nac
R52 R53 = RES_0805
  R52: Value: 7.5k
  R53: Value: 39k
R54 = RES semi: as R51 on sheet FPGA; Power: *; TCR: *; Series: *; Tolerance: *
U13 = CMP-0395-00327-2: as U1 on sheet ADC; DatasheetVersion: SLVS351N; ComponentLink2Description: Datasheet; PartNumber: TPS79633DCQR; PackageDescription: 6-Pin Plastic Small Outline, Body 3.5 x 6.5 mm, Pitch 1.27 mm; ComponentLink1Description: Manufacturer URL; ComponentLink2URL: http://www.ti.com/general/docs/lit/getliterature.tsp?genericPartNumber=TPS79633&fileType=pdf; ComponentLink3URL: http://www.ti.com/litv/pdf/mpds098c; Mounting Technology: Surface Mount; Fixed Output Options(V): 3.3; PackageReference: DCQ0006A; ComponentLink1URL: http://www.ti.com/; PackageVersion: 4202109/D; ComponentLink3Description: Package Specification; Vout Adj(Max)(V): 3.3; Eco-Plan: Green (RoHS & no Sb/Br)
U15 = LM1117DT-2.5: Integrated Circuit; Manufacturer_Name: Texas Instruments; Datasheet Link: https://datasheet.datasheetarchive.com/originals/distributors/Datasheets-22/DSA-425562.pdf; Height: 2.38mm; Manufacturer_Part_Number: LM1117DT-2.5; Mouser Part Number: 926-LM1117DT-25; Mouser Price/Stock: https://www.mouser.com/Search/Refine.aspx?Keyword=926-LM1117DT-25
U16 = LM1117DT-1.8: Integrated Circuit; Manufacturer_Name: Texas Instruments; Datasheet Link: https://datasheet.datasheetarchive.com/originals/distributors/SFDatasheet-3/sf-00077938.pdf; Height: 2.38mm; Manufacturer_Part_Number: LM1117DT-1.8; Mouser Part Number: 926-LM1117DT-18; Mouser Price/Stock: https://www.mouser.com/Search/Refine.aspx?Keyword=926-LM1117DT-18
U12 = ST1S10: Value: ST1S10

## Sheet STM32.SchDoc: STM32
size A3; DocumentNumber: 11; Revision: 2.0; SheetNumber: 11; SheetTotal: 18
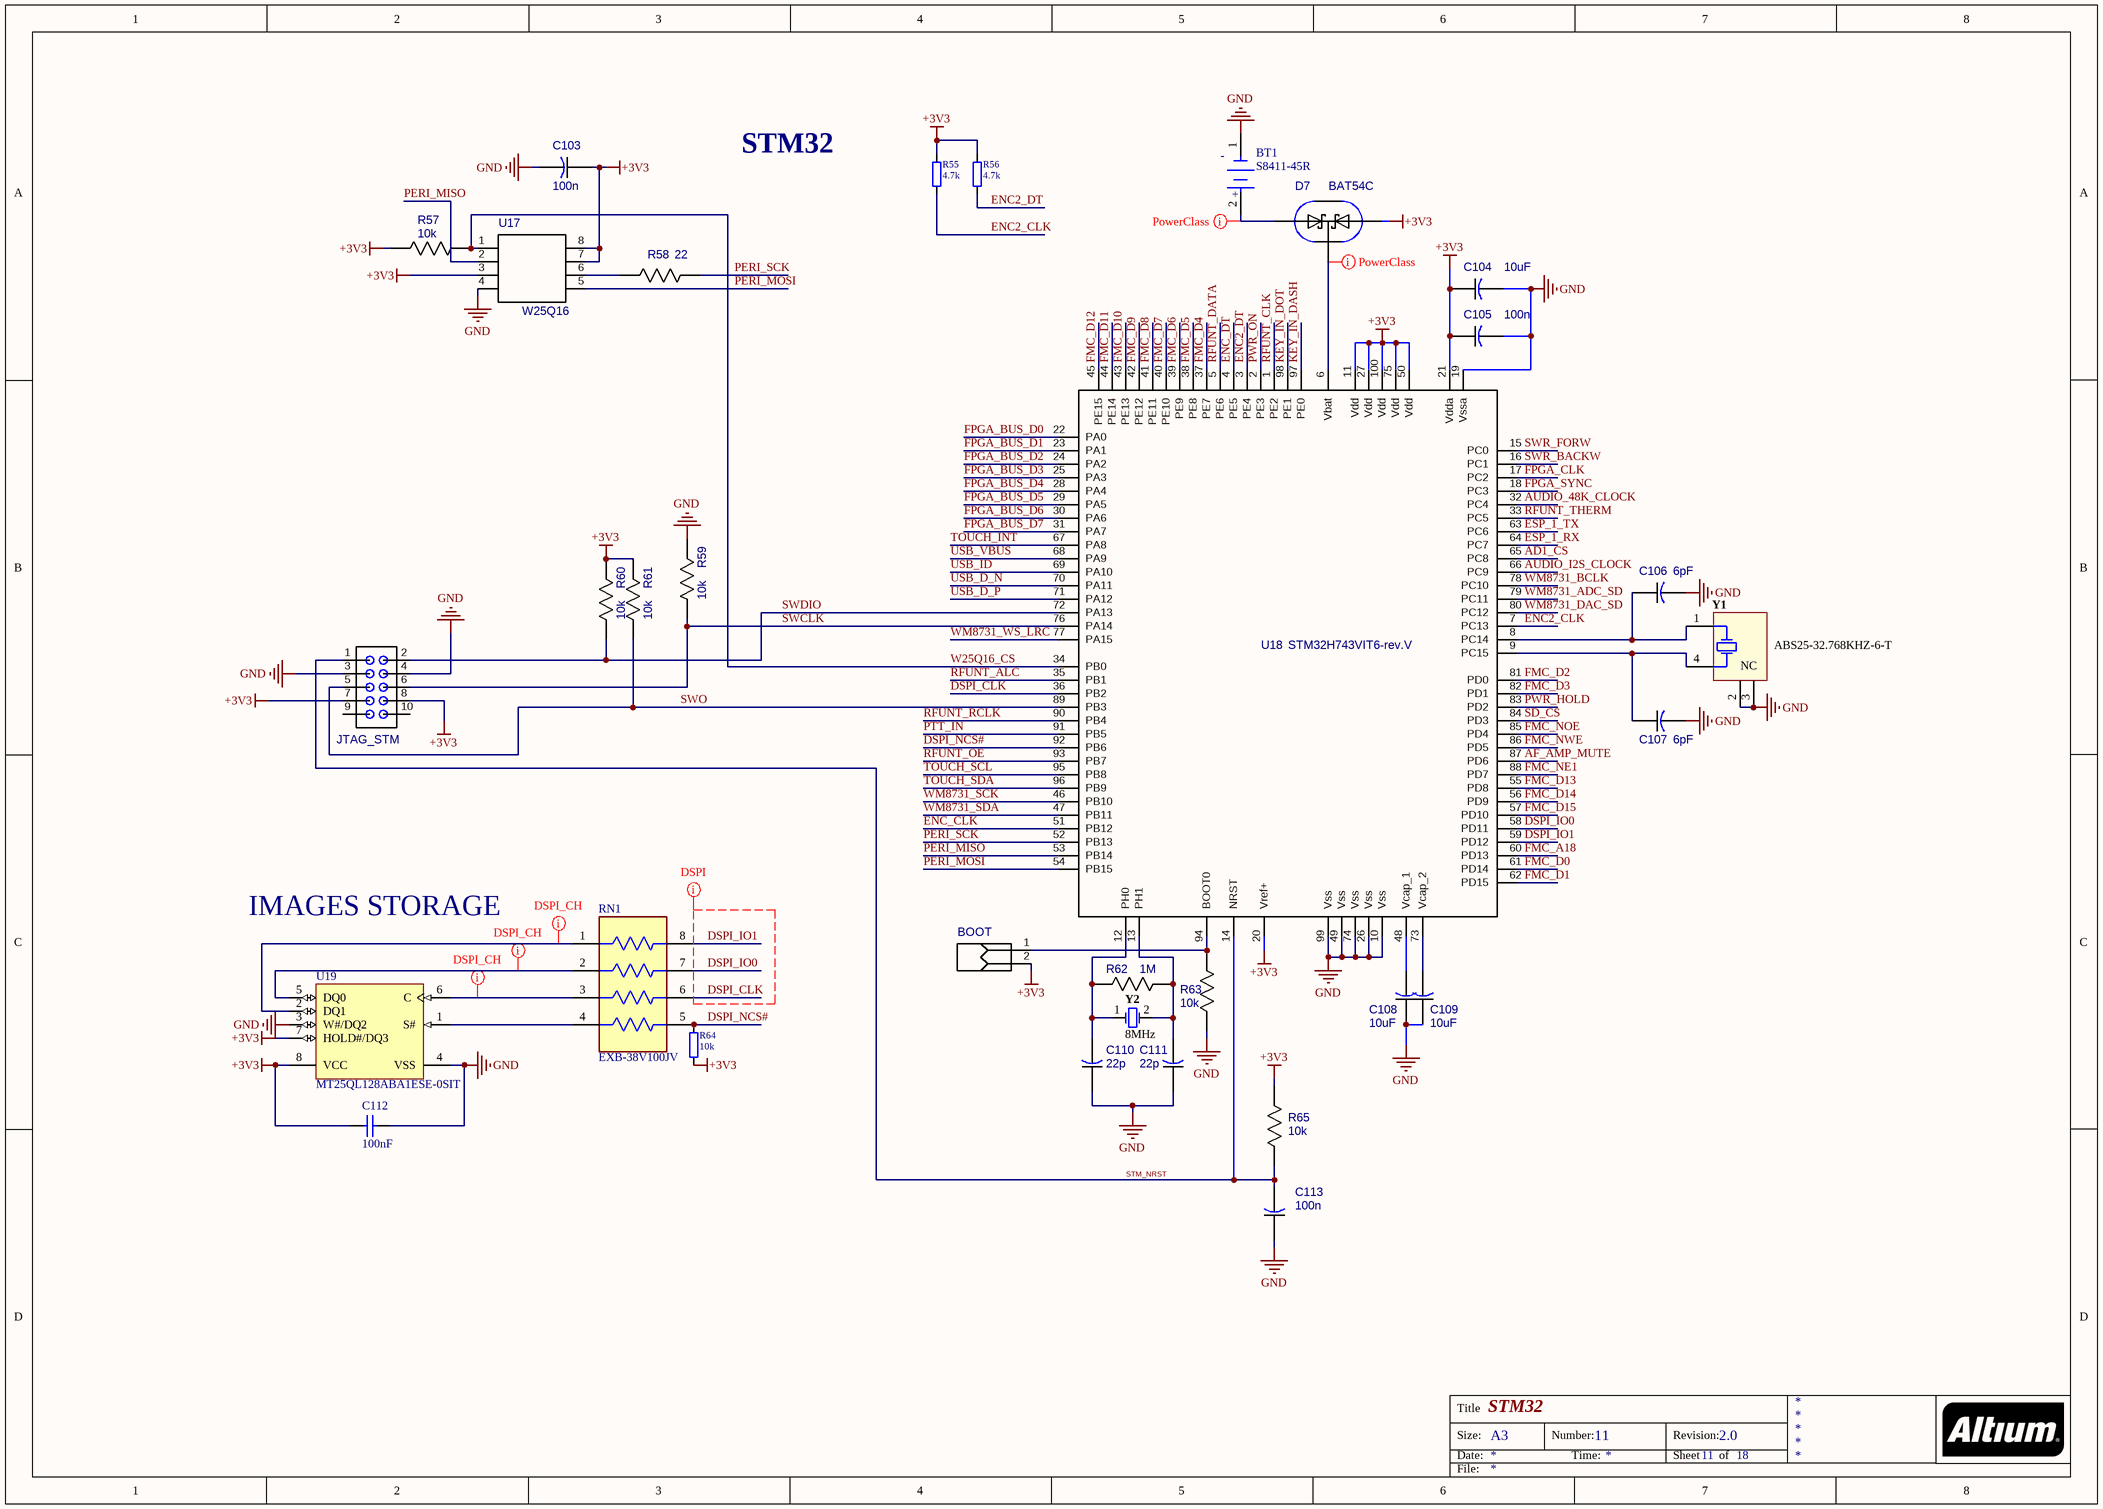
[diagram p5: STM32.SchDoc]

### Parts
BOOT  (no value)  [51022-0200]
BT1  S8411-45R  [FP-S8411-45R-MFG]
C103  100n  [CAP_0805]
C104  10uF  [CAP_0805]
C105  100n  [CAP_0805]
C106  6pF  [CAP_0805]
C107  6pF  [CAP_0805]
C108  10uF  [CAP_0805]
C109  10uF  [CAP_0805]
C110  22p  [CAP_0805]
C111  22p  [CAP_0805]
C112  100nF  [C-0805]
C113  100n  [CAP_0805]
D7  BAT54C  [BAT54C]
JTAG_STM  (no value)  [IDC10]
R55  4.7k  [R-0603]
R56  4.7k  [R-0603]
R57  10k  [RES_0805]
R58  22  [RES_0805]
R59  10k  [RES_0805]
R60  10k  [RES_0805]
R61  10k  [RES_0805]
R62  1m  [RES_0805]
R63  10k  [RES_0805]
R64  10k  [R-0603]
R65  10k  [RES_0805]
RN1  EXB-38V100JV  [FP-EXB38V-MFG]
U17  W25Q16  [W25Q16]
U18  STM32H743VIT6-rev.V  [STM32H743VIT6]
U19  MT25QL128ABA1ESE-0SIT  [MICT-SE-8_M]
Y1  ABS25-32.768KHZ-6-T  [ABRA-ABS25-4_V]
Y2  8MHz  [FOX-FOXSLF-2_V]

### Nets
+3V3: BOOT.2 C103.1 C104.1 C105.1 C112.1 D7.1((A1)) JTAG_STM.7 JTAG_STM.8 R55.2 R56.2 R57.1 R60.1 R61.1 R64.1 R65.2 U17.3(WP) U17.7(HOLD) U17.8(VCC) U18.11(Vdd) U18.20(Vref+) U18.21(Vdda) U18.27(Vdd) U18.50(Vdd) U18.75(Vdd) U18.100(Vdd) U19.7(HOLD#/DQ3) U19.8(VCC)
GND: BT1.1(C) C103.2 C104.2 C105.2 C106.2 C107.2 C108.1 C109.1 C110.1 C111.1 C112.2 C113.1 JTAG_STM.3 JTAG_STM.4 R59.1 R63.1 U17.4(GND) U18.10(Vss) U18.19(Vssa) U18.26(Vss) U18.49(Vss) U18.74(Vss) U18.99(Vss) U19.3(W#/DQ2) U19.4(VSS) Y1.2(NC) Y1.3(NC)
AD1_CS: U18.65(PC8)
AF_AMP_MUTE: U18.87(PD6)
AUDIO_48K_CLOCK: U18.32(PC4)
AUDIO_I2S_CLOCK: U18.66(PC9)
DSPI_CLK: RN1.6 U18.36(PB2)
DSPI_IO0: RN1.7 U18.58(PD11)
DSPI_IO1: RN1.8 U18.59(PD12)
DSPI_NCS#: R64.2 RN1.5 U18.92(PB6)
ENC2_CLK: R55.1 U18.7(PC13)
ENC2_DT: R56.1 U18.3(PE4)
ENC_CLK: U18.51(PB12)
ENC_DT: U18.4(PE5)
ESP_1_RX: U18.64(PC7)
ESP_1_TX: U18.63(PC6)
FMC_A18: U18.60(PD13)
FMC_D0: U18.61(PD14)
FMC_D1: U18.62(PD15)
FMC_D2: U18.81(PD0)
FMC_D3: U18.82(PD1)
FMC_D4: U18.37(PE7)
FMC_D5: U18.38(PE8)
FMC_D6: U18.39(PE9)
FMC_D7: U18.40(PE10)
FMC_D8: U18.41(PE11)
FMC_D9: U18.42(PE12)
FMC_D10: U18.43(PE13)
FMC_D11: U18.44(PE14)
FMC_D12: U18.45(PE15)
FMC_D13: U18.55(PD8)
FMC_D14: U18.56(PD9)
FMC_D15: U18.57(PD10)
FMC_NE1: U18.88(PD7)
FMC_NOE: U18.85(PD4)
FMC_NWE: U18.86(PD5)
FPGA_BUS_D0: U18.22(PA0)
FPGA_BUS_D1: U18.23(PA1)
FPGA_BUS_D2: U18.24(PA2)
FPGA_BUS_D3: U18.25(PA3)
FPGA_BUS_D4: U18.28(PA4)
FPGA_BUS_D5: U18.29(PA5)
FPGA_BUS_D6: U18.30(PA6)
FPGA_BUS_D7: U18.31(PA7)
FPGA_CLK: U18.17(PC2)
FPGA_SYNC: U18.18(PC3)
KEY_IN_DASH: U18.97(PE0)
KEY_IN_DOT: U18.98(PE1)
PERI_MISO: U17.2(SO) U18.53(PB14)
PERI_MOSI: U17.5(SI) U18.54(PB15)
PERI_SCK: R58.2 U18.52(PB13)
PTT_IN: U18.91(PB5)
PWR_HOLD: U18.83(PD2)
PWR_ON: U18.2(PE3)
RFUNT_ALC: U18.35(PB1)
RFUNT_CLK: U18.1(PE2)
RFUNT_DATA: U18.5(PE6)
RFUNT_OE: U18.93(PB7)
RFUNT_RCLK: U18.90(PB4)
RFUNT_THERM: U18.33(PC5)
SD_CS: U18.84(PD3)
STM_NRST: C113.2 JTAG_STM.1 R65.1 U18.14(NRST)
SWCLK: JTAG_STM.6 R59.2 U18.76(PA14)
SWDIO: JTAG_STM.2 R60.2 U18.72(PA13)
SWO: JTAG_STM.5 R61.2 U18.89(PB3)
SWR_BACKW: U18.16(PC1)
SWR_FORW: U18.15(PC0)
TOUCH_INT: U18.67(PA8)
TOUCH_SCL: U18.95(PB8)
TOUCH_SDA: U18.96(PB9)
USB_D_N: U18.70(PA11)
USB_D_P: U18.71(PA12)
USB_ID: U18.69(PA10)
USB_VBUS: U18.68(PA9)
W25Q16_CS: R57.2 U17.1(CS) U18.34(PB0)
WM8731_ADC_SD: U18.79(PC11)
WM8731_BCLK: U18.78(PC10)
WM8731_DAC_SD: U18.80(PC12)
WM8731_SCK: U18.46(PB10)
WM8731_SDA: U18.47(PB11)
WM8731_WS_LRC: U18.77(PA15)
NetBOOT_1: BOOT.1 R63.2 U18.94(BOOT0)
NetBT1_2: BT1.2(A) D7.2((A2))
NetC106_1: C106.1 U18.8(PC14) Y1.1(X1)
NetC107_1: C107.1 U18.9(PC15) Y1.4(X2)
NetC108_2: C108.2 U18.48(Vcap_1)
NetC109_2: C109.2 U18.73(Vcap_2)
NetC110_2: C110.2 R62.1 U18.12(PH0) Y2.1
NetC111_2: C111.2 R62.2 U18.13(PH1) Y2.2
NetD7_3: D7.3((K1),(K2)) U18.6(Vbat)
NetR58_1: R58.1 U17.6(CLK)
NetRN1_1: RN1.1 U19.2(DQ1)
NetRN1_2: RN1.2 U19.5(DQ0)
NetRN1_3: RN1.3 U19.6(C)
NetRN1_4: RN1.4 U19.1(S#)

Not connected (* = marked no-connect by the designer): JTAG_STM 9 10

### Layout directives
net class PowerPads: NetBT1_2, NetD7_3
rule Matched Net Lengths [Tolerance = 100mil]; net class DSPI: DSPI_CLK, DSPI_IO0, DSPI_IO1
rule Matched Net Lengths [Tolerance = 100mil]; net class DSPI_CH: NetRN1_1, NetRN1_2, NetRN1_3

### Notes on the sheet
- STM32
- IMAGES STORAGE
- Title
- Size:
- Date:
- A3
- Number:
- Time:
- Revision:
- Sheet
- of
- File:
- (in symbol CMP-15817-000007-1) -; +

### Library data of the parts
BOOT = 51022-0200: 2 Pin
BT1 = CMP-15817-000007-1: BATTERY HOLDER COIN 12MM SMD; Number of Batteries: 1; Material: Polyphenylene; Case/Package: SMD/SMT; Number of Cells: 1; Min Operating Temperature: -55°C; Termination: SMD/SMT; REACH SVHC: No SVHC; Contact Plating: Bronze; Package Quantity: 500; Max Operating Temperature: 105°C; Mount: Surface Mount; Packaging: Tape and Reel
C103-C111 C113 = CAP_0805
  C103 C105 C113: Value: 100n
  C104 C108 C109: Value: 10uF
  C110 C111: Value: 22p
C112 = C semi: Ceramic Multilayer Capacitor; Manufacturer: Yageo/Phycomp; Manufacturer P/N: CC0603JRNPO9BN102; numsch: 011; TypeNum: 155; Parameters: 1nF, NP0, 50V, ±5%; Tolerance: ±10%; Voltage: *
JTAG_STM = IDC10: 2*5 Pin
R55 R56 R64 = RES semi: as R51 on sheet FPGA; Power: *; TCR: *; Series: *; Tolerance: *
R57-R63 R65 = RES_0805
  R57 R59-R61 R63 R65: Value: 10k
  R58: Value: 22
  R62: Value: 1M
RN1 = CMP-05421-000006-1: RES ARRAY 4 RES 10 OHM 1206; Voltage Rating (DC): 100V; Number of Elements: 4; Power Per Element: 62.5mW; Resistance Tolerance: 5%; Power Dissipation: 63mW; Circuit Type: Isolated; Number of Terminals/Pins: 8; Temperature Coefficient: 200ppm/°C; Resistance: 10R; Voltage Rating: 50V; Packaging: Tape and Reel; Terminal Pitch: 0.8mm; Depth: 1.6mm; Series: EXB; Max Operating Temperature: 125°C; Military Standard: Not; Number of Resistors: 4; RoHS Compliant: Yes; Case Code (Metric): 3216; Mount: Surface Mount; Height: 0.024inch; Lead Free: Lead Free; Width: 0.063inch; Contact Plating: Tin; Number of Pins: 8; Length: 3.2mm; Technology: THICK FILM; Case/Package: 1206; Package Quantity: 1; Min Operating Temperature: -55°C; Size Code: 0603; Termination: Convex; Radiation Hardening: No; Tolerance: 5%; Case Code (Imperial): 1206; Number of Contacts: 8
U18 = STM32H743VIT6: Value: STM32H743VIT6-rev.V
U19 = CMP-2000-07468-1: Micron Serial NOR Flash Memory, 2.7 to 3.6 V, 128 Mb, -40 to 85 degC, 8-Pin SOP2 (SE), RoHS, Tape and Reel; Mounting Technology: SurfaceMount; Package Reference: SE-8; Package Description: 8-Pin Small Outline Package, Body 5.285 x 5.285 mm, Pitch 1.27 mm; Manufacturer: Micron; Manufacturer URL: http://www.micron.com/; Datasheet URL: https://www.micron.com/~/media/documents/products/data-sheet/nor-flash/serial-nor/mt25q/die-rev-a/mt25q_qlhs_l_128_aba_0.pdf; Datasheet Version: Rev. I , 09/2016; RoHSCompliant: true
Y1 = CMP-2000-05036-1: Low Frequency Crystal, 32.768 KHz, 6 pF, +/- 20 ppm, -40 to 85 degC, 4-Pin SMD, RoHS, Tape and Reel; Manufacturer: Abracon; Tolerance: 20PPM; ESR: 50kOhms; Case Width: 3.8mm; Case Height: 2.5mm; Case Length: 8mm; Load Capacitance: 6pF; Operating Temperature Range: -40Cto+85C; Package Reference: ABS25; Factory Pack Quantity: 3000; Package Description: 4-Pin Surface Mount Device, Body 8 x 3.8 mm, Pitch 5.5 mm; Frequency: 32.768kHz; Termination Style: SMD/SMT; Manufacturer URL: http://www.abracon.com/; Type: LowFrequencyCrystal; Dimensions: 3.8mmWx8mmLx2.5mmH; Product Category: Crystals; Series: ABS25; RoHS: Details; Package / Case: 8mmx3.8mm; Datasheet Version: Jun-17; Brand: ABRACON; Datasheet URL: https://datasheet.ciiva.com/854/abs25-854528.pdf; Packaging: Reel; Mounting Style: SMD/SMT
Y2 = CMP-1749-00004-1: Resistance Weld Thru-Hole Crystal, 8 MHz, +/-30 ppm, -20 to 70 degC, 2-Pin THD, RoHS, Bulk; Elements: 1; Rds On Max: 115 mohm; Typical Rise Time: 90 ns; Max Power Dissipation: 2.5 W; Case\Package: TO-251-3; Input Capacitance: 350 pF; REACH SVHC: No SVHC; Length: 6.6 mm; ComponentLink1URL: http://www.foxonline.com/; PackageDescription: 2-Pin Through Hole Device, Body 11.35 x 4.65 mm, Pitch 4.88 mm; Radiation Hardening: No; Package Quantity: 70; Packaging: Rail/Tube; ComponentLink1Description: Manufacturer URL; Min Operating Temperature: -55 degC; Max Operating Temperature: 150 degC; RoHSCompliant: true; PackageReference: FOXSLF-2; DatasheetVersion: Mar-15; Pins: 3; Height: 6.1 mm; Mount: Through Hole; ComponentLink2URL: http://www.foxonline.com/pdfs/hc49slf.pdf; ComponentLink2Description: Datasheet; Width: 2.3 mm
D7 = BAT54C: Value: BAT54C
U17 = W25Q16: Value: W25Q16

## Sheet CLOCK_GENERATOR.SchDoc: CLOCK_GENERATOR
size A4; DocumentNumber: 6; Revision: 2.0; SheetNumber: 6; SheetTotal: 18
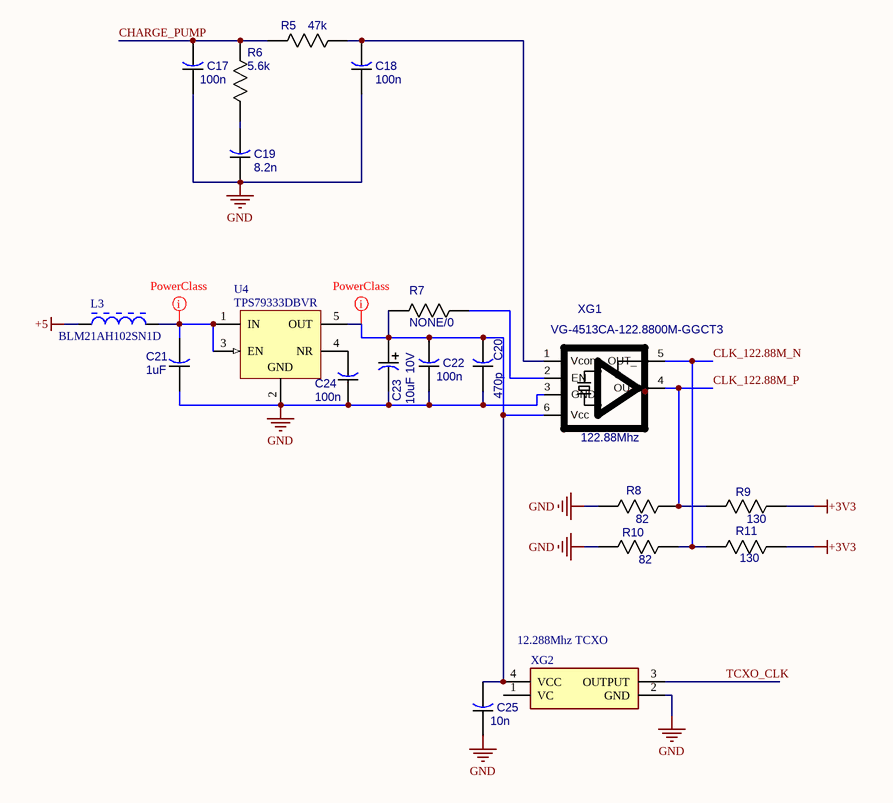
[diagram p6: CLOCK_GENERATOR.SchDoc]

### Parts
C17  100n  [CAP_0805]
C18  100n  [CAP_0805]
C19  8.2n  [CAP_0805]
C20  470p  [CAP_0805]
C21  1uF  [CAP_0805]
C22  100n  [CAP_0805]
C23  10uF 10V  [CAPAE_4.3x4.3h5.4]
C24  100n  [CAP_0805]
C25  10n  [CAP_0805]
L3  BLM21AH102SN1D  [INDC2013X105X50NL20T20]
R5  47k  [RES_0805]
R6  5.6k  [RES_0805]
R7  value NONE/0  [RES_0805]  (hidden comment: 0/NONE)
R8  82  [RES_0805]
R9  130  [RES_0805]
R10  82  [RES_0805]
R11  130  [RES_0805]
U4  TPS79333DBVR  [DBV0005A_L]
XG1  VG-4513CA-122.8800M-GGCT3  value 122.88Mhz  [NV7050SA]
XG2  12.288Mhz TCXO  [581L200X2ITT]

### Nets
+3V3: R9.1 R11.1
+5: L3.1
CLK_122.88M_N: R10.1 R11.2 XG1.5(OUT_)
CLK_122.88M_P: R8.1 R9.2 XG1.4(OUT)
GND: C17.1 C18.1 C19.1 C20.1 C21.1 C22.1 C23.2(MINUS) C24.1 C25.1 R8.2 R10.2 U4.2(GND) XG1.3(GND) XG2.2(GND)
CHARGE_PUMP: C17.2 R5.1 R6.1
TCXO_CLK: XG2.3(OUTPUT)
NetC18_2: C18.2 R5.2 XG1.1(Vcont)
NetC19_2: C19.2 R6.2
NetC20_2: C20.2 C22.2 C23.1(PLUS) C25.2 R7.1 U4.5(OUT) XG1.6(Vcc) XG2.4(VCC)
NetC21_2: C21.2 L3.2 U4.1(IN) U4.3(EN)
NetC24_2: C24.2 U4.4(NR)
NetR7_2: R7.2 XG1.2(EN)

Not connected (* = marked no-connect by the designer): XG2 1(VC)

### Layout directives
net class PowerPads: NetC20_2, NetC21_2

### Notes on the sheet
- Title
- Size:
- Date:
- A4
- Number:
- Time:
- Revision:
- Sheet
- of
- File:

### Library data of the parts
C17-C22 C24 C25 = CAP_0805
  C20: Value: 470p
  C21: Value: 1uF
  C22 C24: Value: 100n
  C25: Value: 10n
C23 = CAPAE_4.3x4.3h5.4: Value: 10uF 10V
L3 = CMP-2000-05954-1: as L1 on sheet ADC; Datasheet URL: http://datasheet.octopart.com/BLM21AH102SN1D-Murata-datasheet-629859.pdf; Datasheet Version: 11/2017; Dimensions: 1.25mmWx2mmLx0.85mmH; Manufacturer URL: http://www.murata.com/; Packaging: Reel; Product: FerriteChipBeads; Product Category: EMIFilterBeads,Chips&Arrays; Operating Temperature Range: -55Cto+125C; Package / Case: 0805(2012metric); Series: BLM21A; Mounting Technology: SurfaceMount; Termination Style: SMD/SMT; Tolerance: 25%; RoHS: Details; Package Reference: 0805; Factory Pack Quantity: 4000; Package Description: 2-Pin Surface Mount Device, Body 2 x1.25 mm
R5 R6 R8-R11 = RES_0805
  R8 R10: Value: 82
  R9 R11: Value: 130
R7 = RES_0805: By used crystal
U4 = CMP-0394-00364-2: as U7 on sheet DAC; ComponentLink1URL: http://www.ti.com/; ComponentLink2URL: http://www.ti.com/general/docs/lit/getliterature.tsp?genericPartNumber=TPS79333&fileType=pdf; ComponentLink1Description: Manufacturer URL; PackageDescription: 5-Pin Plastic Small Outline, Body 1.60 Ãƒâ€” 2.90 mm, Pitch 0.95 mm; ComponentLink3URL: http://www.ti.com/litv/pdf/mpds018i; ComponentLink2Description: Datasheet; Mounting Technology: Surface Mount; ComponentLink3Description: Package Specification; PackageReference: DBV0005A; Code_JEDEC: MO-178; PartNumber: TPS79333DBVR; Vout Adj(Min)(V): 3.3; DatasheetVersion: SLVS348K; Eco-Plan: Green (RoHS & no Sb/Br); PackageVersion: 4073253-4/K; Vout Adj(Max)(V): 3.3; Iq(Typ)(mA): 0.2
XG1 = NV7050SA: NV7050SA VG-4513CA-122.8800M-GGCT3
XG2 = 581L200X2ITT: Crystal or Oscillator; Manufacturer_Name: CTS; Datasheet Link: https://componentsearchengine.com/Datasheets/1/581L200X2ITT.pdf; Height: 1.65mm; Manufacturer_Part_Number: 581L200X2ITT; Mouser Part Number: 774-581L200X2ITT; Mouser Price/Stock: https://www.mouser.com/Search/Refine.aspx?Keyword=774-581L200X2ITT

## Sheet CONNECTIONS.SchDoc: CONNECTIONS
size A4; DocumentNumber: 7; Revision: 2.0; SheetNumber: 7; SheetTotal: 18
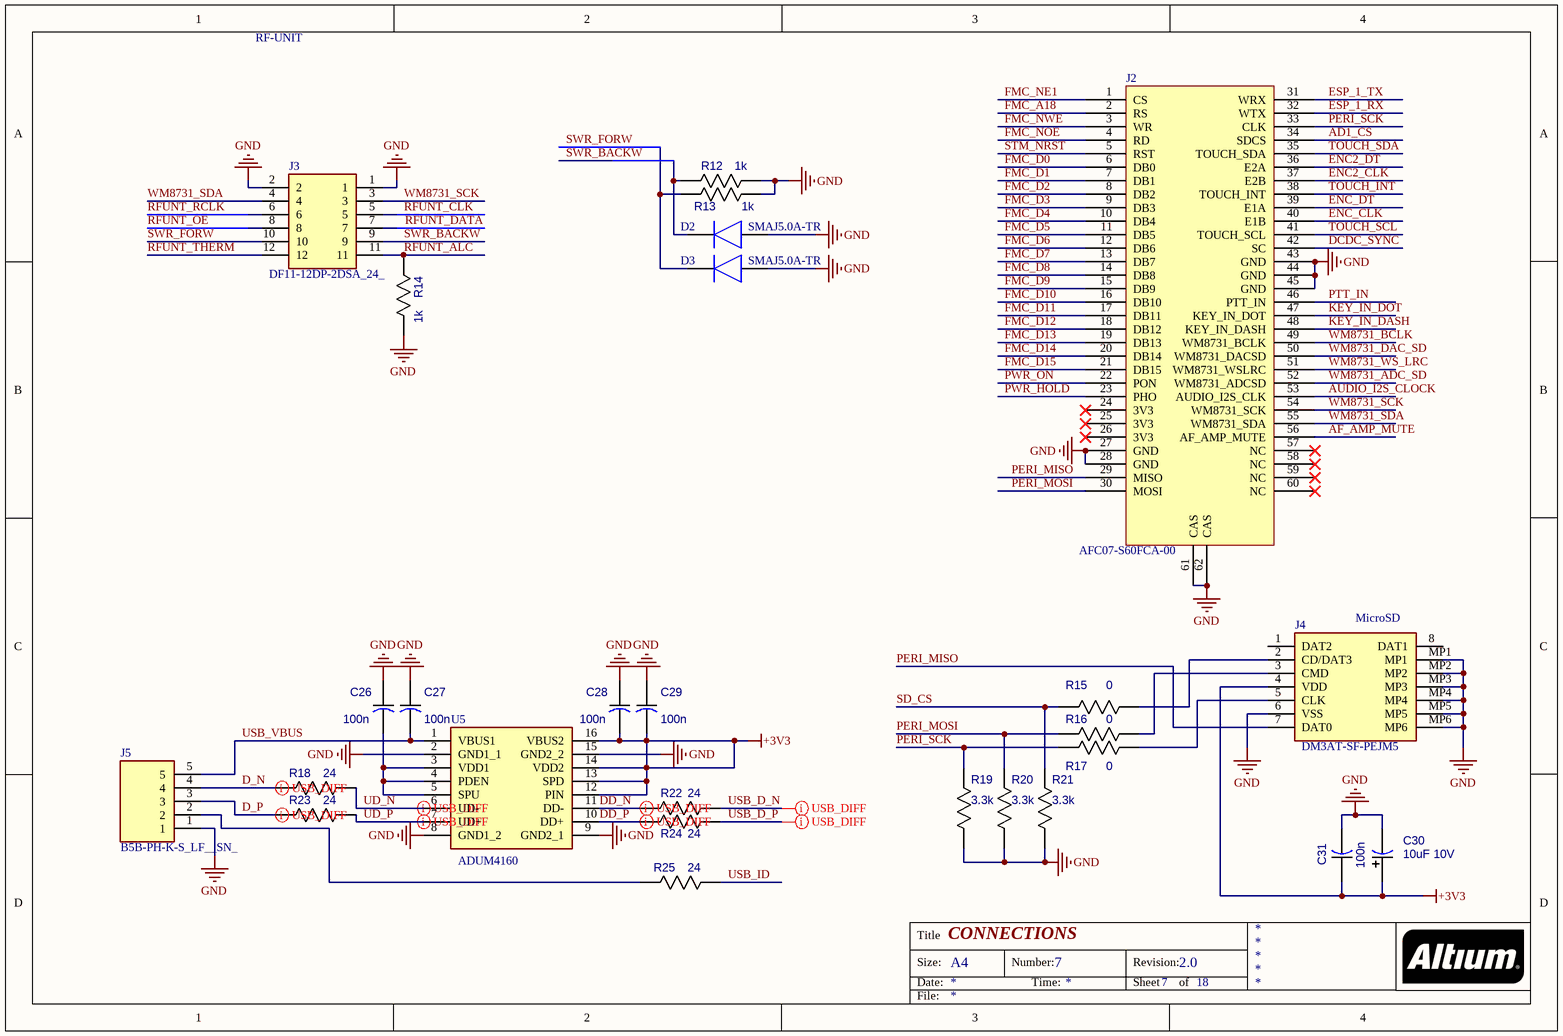
[diagram p7: CONNECTIONS.SchDoc]

### Parts
C26  100n  [CAP_0805]
C27  100n  [CAP_0805]
C28  100n  [CAP_0805]
C29  100n  [CAP_0805]
C30  value 10uF 10V  [CAPAE_4.3x4.3h5.4]  (hidden comment: 22uF 10V)
C31  100n  [CAP_0805]
D2  SMAJ5.0A-TR  [SMBJ36CATR]
D3  SMAJ5.0A-TR  [SMBJ36CATR]
J2  AFC07-S60FCA-00  [AFC07-S60FCA-00]
J3  DF11-12DP-2DSA_24_  [SHDR12W60P200_2X6_1400X500X690P]
J4  DM3AT-SF-PEJM5  [DM3ATSFPEJM5]
J5  B5B-PH-K-S_LF__SN_  [SHDR5W50P0X200_1X5_1190X450X600P]
R12  1k  [RES_0805]
R13  1k  [RES_0805]
R14  1k  [RES_0805]
R15  0  [RES_0805]
R16  0  [RES_0805]
R17  0  [RES_0805]
R18  24  [RES_0805]
R19  3.3k  [RES_0805]
R20  3.3k  [RES_0805]
R21  3.3k  [RES_0805]
R22  24  [RES_0805]
R23  24  [RES_0805]
R24  24  [RES_0805]
R25  24  [RES_0805]
U5  ADUM4160  [SOIC127P1032X265-16N]

### Nets
+3V3: C28.2 C29.2 C30.1(PLUS) C31.1 J4.4(VDD) U5.12(PIN) U5.13(SPD) U5.14(VDD2) U5.16(VBUS2)
GND: C26.1 C27.1 C28.1 C29.1 C30.2(MINUS) C31.2 D2.2(A) D3.2(A) J2.27(GND) J2.28(GND) J2.43(GND) J2.44(GND) J2.45(GND) J2.61(CAS) J2.62(CAS) J3.1 J3.2 J4.6(VSS) J4.MP1 J4.MP2 J4.MP3 J4.MP4 J4.MP5 J4.MP6 J5.1 R12.2 R13.2 R14.2 R19.1 R20.1 R21.1 U5.2(GND1_1) U5.8(GND1_2) U5.9(GND2_1) U5.15(GND2_2)
AD1_CS: J2.34(SDCS)
AF_AMP_MUTE: J2.56(AF_AMP_MUTE)
AUDIO_I2S_CLOCK: J2.53(AUDIO_I2S_CLK)
D_N: J5.4 R18.1
D_P: J5.3 R23.1
DCDC_SYNC: J2.42(SC)
DD_N: R22.1 U5.11(DD-)
DD_P: R24.1 U5.10(DD+)
ENC2_CLK: J2.37(E2B)
ENC2_DT: J2.36(E2A)
ENC_CLK: J2.40(E1B)
ENC_DT: J2.39(E1A)
ESP_1_RX: J2.32(WTX)
ESP_1_TX: J2.31(WRX)
FMC_A18: J2.2(RS)
FMC_D0: J2.6(DB0)
FMC_D1: J2.7(DB1)
FMC_D2: J2.8(DB2)
FMC_D3: J2.9(DB3)
FMC_D4: J2.10(DB4)
FMC_D5: J2.11(DB5)
FMC_D6: J2.12(DB6)
FMC_D7: J2.13(DB7)
FMC_D8: J2.14(DB8)
FMC_D9: J2.15(DB9)
FMC_D10: J2.16(DB10)
FMC_D11: J2.17(DB11)
FMC_D12: J2.18(DB12)
FMC_D13: J2.19(DB13)
FMC_D14: J2.20(DB14)
FMC_D15: J2.21(DB15)
FMC_NE1: J2.1(CS)
FMC_NOE: J2.4(RD)
FMC_NWE: J2.3(WR)
KEY_IN_DASH: J2.48(KEY_IN_DASH)
KEY_IN_DOT: J2.47(KEY_IN_DOT)
PERI_MISO: J2.29(MISO) J4.7(DAT0)
PERI_MOSI: J2.30(MOSI) R16.2 R20.2
PERI_SCK: J2.33(CLK) R17.2 R19.2
PTT_IN: J2.46(PTT_IN)
PWR_HOLD: J2.23(PHO)
PWR_ON: J2.22(PON)
RFUNT_ALC: J3.11 R14.1
RFUNT_CLK: J3.5
RFUNT_DATA: J3.7
RFUNT_OE: J3.8
RFUNT_RCLK: J3.6
RFUNT_THERM: J3.12
SD_CS: R15.2 R21.2
STM_NRST: J2.5(RST)
SWR_BACKW: D2.1(K) J3.9 R12.1
SWR_FORW: D3.1(K) J3.10 R13.1
TOUCH_INT: J2.38(TOUCH_INT)
TOUCH_SCL: J2.41(TOUCH_SCL)
TOUCH_SDA: J2.35(TOUCH_SDA)
UD_N: R18.2 U5.6(UD-)
UD_P: R23.2 U5.7(UD+)
USB_D_N: R22.2
USB_D_P: R24.2
USB_ID: R25.2
USB_VBUS: C27.2 J5.5 U5.1(VBUS1)
WM8731_ADC_SD: J2.52(WM8731_ADCSD)
WM8731_BCLK: J2.49(WM8731_BCLK)
WM8731_DAC_SD: J2.50(WM8731_DACSD)
WM8731_SCK: J2.54(WM8731_SCK) J3.3
WM8731_SDA: J2.55(WM8731_SDA) J3.4
WM8731_WS_LRC: J2.51(WM8731_WSLRC)
NetC26_2: C26.2 U5.3(VDD1) U5.4(PDEN) U5.5(SPU)
NetJ4_2: J4.2(CD/DAT3) R15.1
NetJ4_3: J4.3(CMD) R16.1
NetJ4_5: J4.5(CLK) R17.1
NetJ5_2: J5.2 R25.1

Not connected (* = marked no-connect by the designer): J2 24(3V3)* 25(3V3)* 26(3V3)* 57(NC)* 58(NC)* 59(NC)* 60(NC)*; J4 1(DAT2) 8(DAT1)

### Layout directives
differential pair; differential pair class USB_DIFF: D_N, D_P, DD_N, DD_P, UD_N, UD_P, USB_D_N, USB_D_P

### Notes on the sheet
- RF-UNIT
- (near J4) MicroSD
- Title
- Size:
- Date:
- A4
- Number:
- Time:
- Revision:
- Sheet
- of
- File:

### Library data of the parts
C26-C29 C31 = CAP_0805: Value: 100n
C30 = CAPAE_4.3x4.3h5.4
D2 D3 = SMLVT3V3: Diode; Manufacturer_Name: STMicroelectronics; Allied_Number: 70013736; Datasheet Link: http://www.st.com/web/en/resource/technical/document/datasheet/CD00000923.pdf; Height: 2.65mm; Manufacturer_Part_Number: SMLVT3V3; Mouser Part Number: 511-SMLVT3V3; Mouser Price/Stock: https://www.mouser.com/Search/Refine.aspx?Keyword=511-SMLVT3V3; RS Part Number: 5444821P; RS Price/Stock: http://uk.rs-online.com/web/p/products/5444821P; Allied Price/Stock: http://www.alliedelec.com/stmicroelectronics-smlvt3v3/70013736/
J3 = DF11-12DP-2DSA_24_: Connector; Manufacturer_Name: Hirose; Manufacturer_Part_Number: DF11-12DP-2DSA(24); Datasheet Link: https://datasheet.datasheetarchive.com/originals/distributors/SFDatasheet-7/sf-000141225.pdf; Height: 6.9mm; Mouser Part Number: 798-DF11-12DP-2DSA24; Mouser Price/Stock: https://www.mouser.co.uk/ProductDetail/Hirose-Connector/DF11-12DP-2DSA24?qs=zOgoZG1CgI9hGIQfeQgy6Q%3D%3D; Arrow Part Number: DF11-12DP-2DSA(24); Arrow Price/Stock: https://www.arrow.com/en/products/df11-12dp-2dsa-24/hirose-electric
J4 = DM3AT-SF-PEJM5: Connector; Manufacturer_Name: HRS(Hirose); Datasheet Link: https://datasheet.lcsc.com/szlcsc/Hirose-HRS-DM3AT-SF-PEJM5_C114218.pdf; Height: 1.83mm; Manufacturer_Part_Number: DM3AT-SF-PEJM5
J5 = B5B-PH-K-S_LF__SN_: Connector; Manufacturer_Name: JST (JAPAN SOLDERLESS TERMINALS); Manufacturer_Part_Number: B5B-PH-K-S(LF)(SN); Datasheet Link: http://uk.rs-online.com/web/p/products/8201438; Height: 6mm; Arrow Part Number: B5B-PH-K-S(LF)(SN); Arrow Price/Stock: https://www.arrow.com/en/products/b5b-ph-k-s-lf-sn/jst-manufacturing
R12-R25 = RES_0805
  R12-R14: Value: 1k
  R15-R17: Value: 0
  R19-R21: Value: 3.3k
U5 = ADUM4160BRWZ: Integrated Circuit; Manufacturer_Name: Analog Devices; Datasheet Link: http://uk.rs-online.com/web/p/products/9129526; Height: 2.65mm; Manufacturer_Part_Number: ADUM4160BRWZ; Mouser Part Number: 584-ADUM4160BRWZ; Mouser Price/Stock: https://www.mouser.co.uk/ProductDetail/Analog-Devices/ADUM4160BRWZ/?qs=WIvQP4zGanj8VHq3sVqu9A%3D%3D; Arrow Part Number: ADUM4160BRWZ; Arrow Price/Stock: https://www.arrow.com/en/products/adum4160brwz/analog-devices